# EAGLE design SP-PC (EAGLE 7.6.0)

## Sheet 1 of 2: Registers
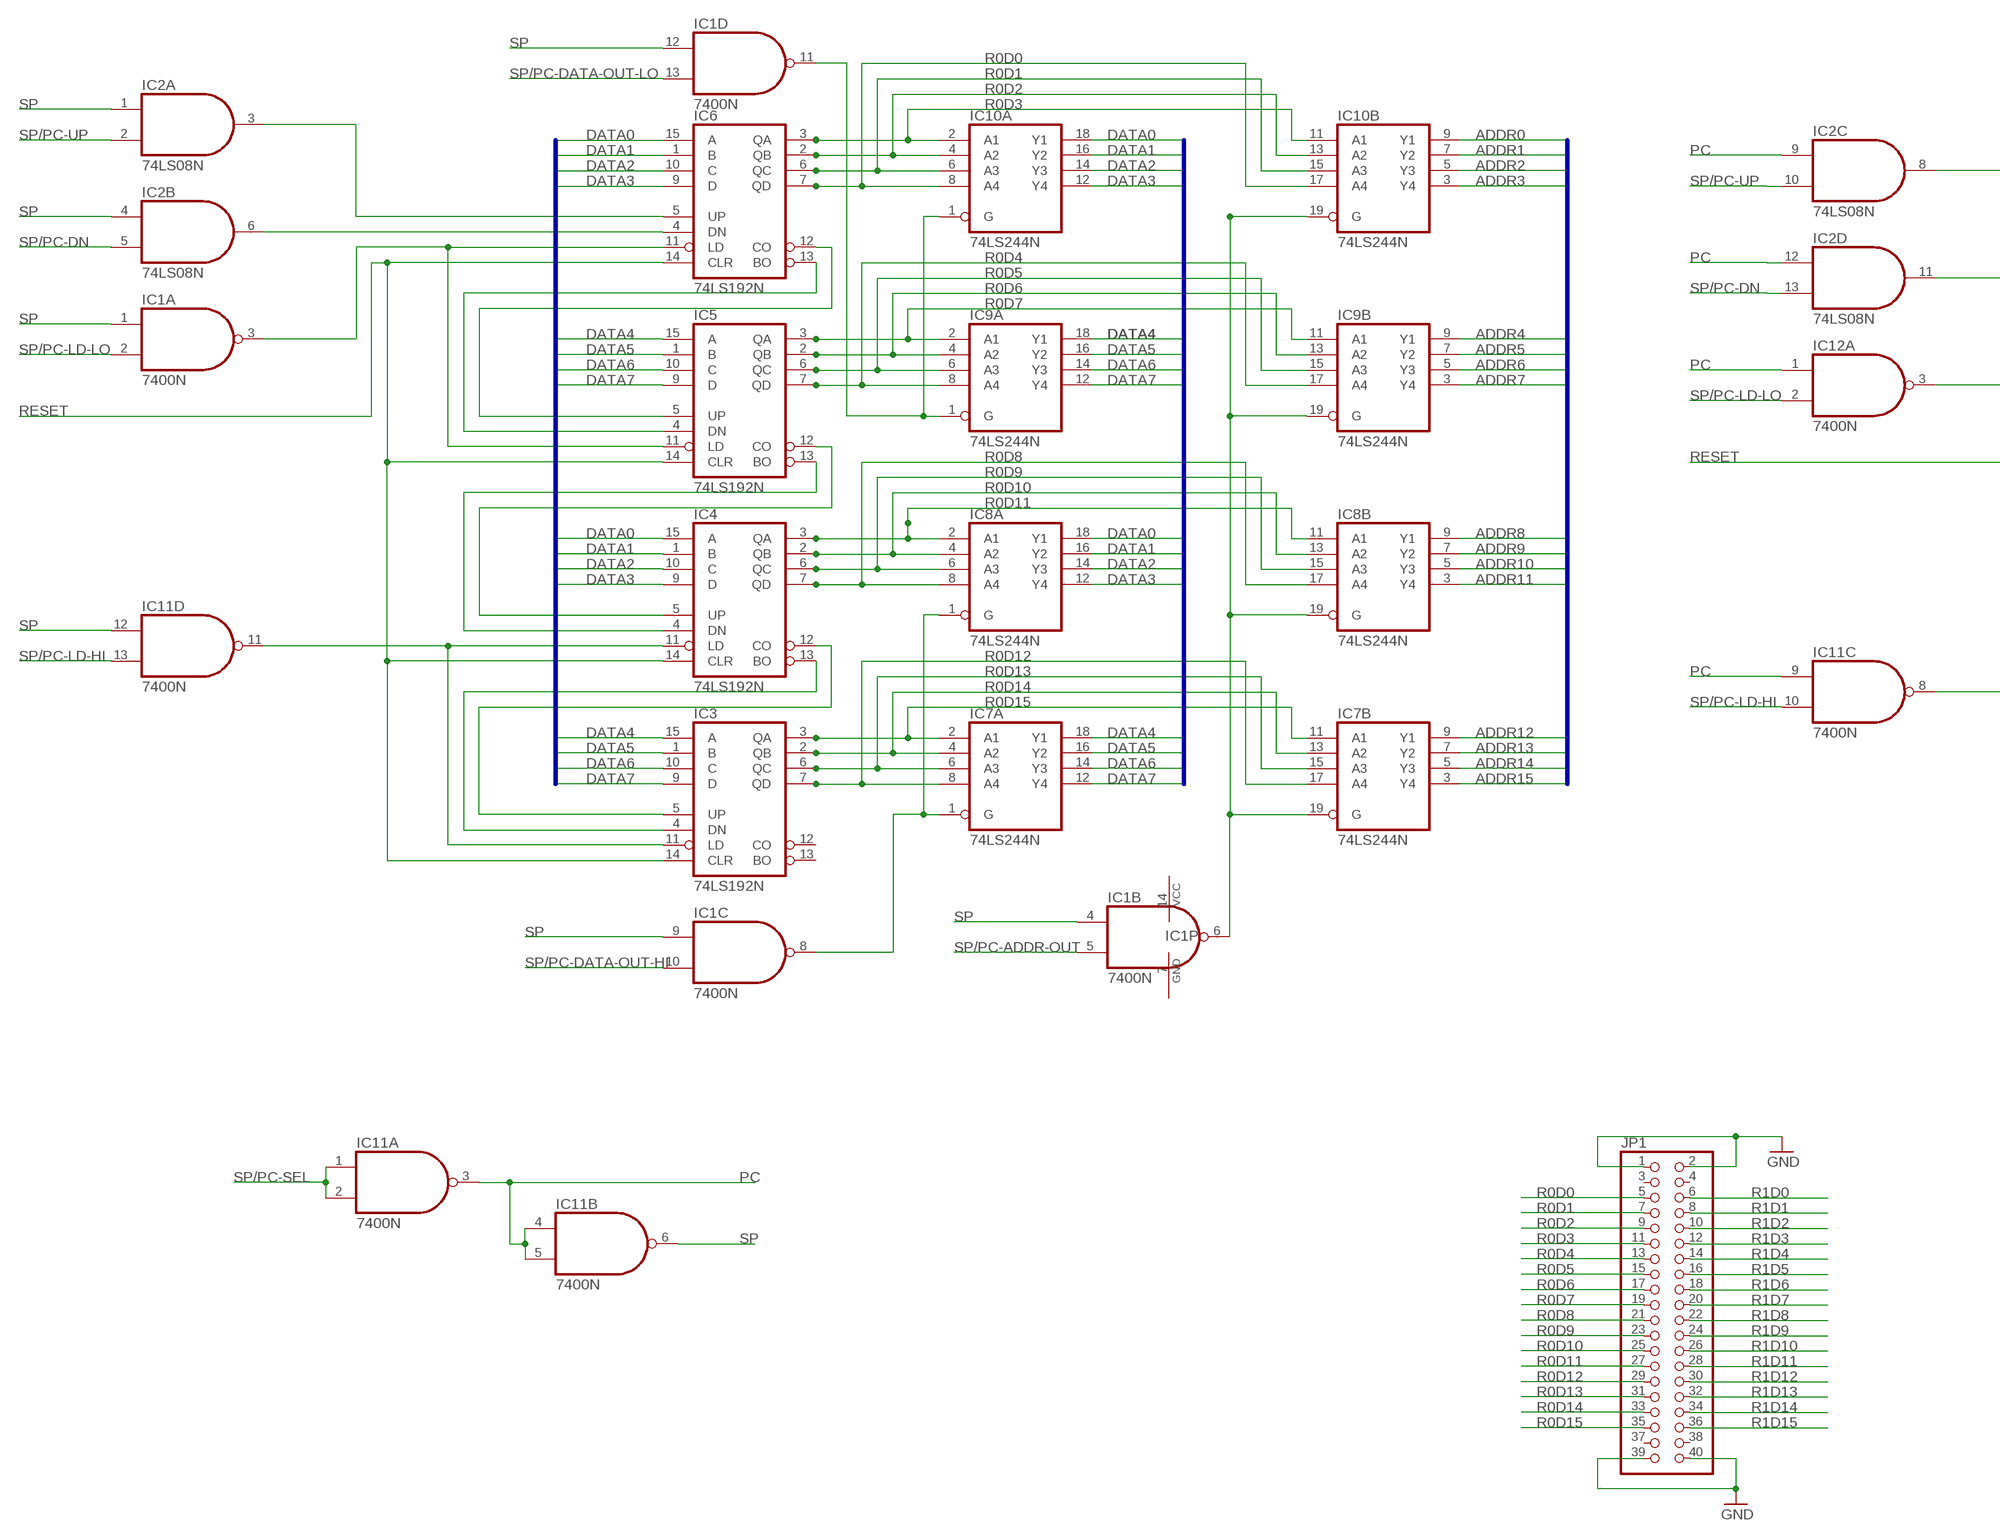
[diagram p0: schematic, sheet 1, part 1 of 2]
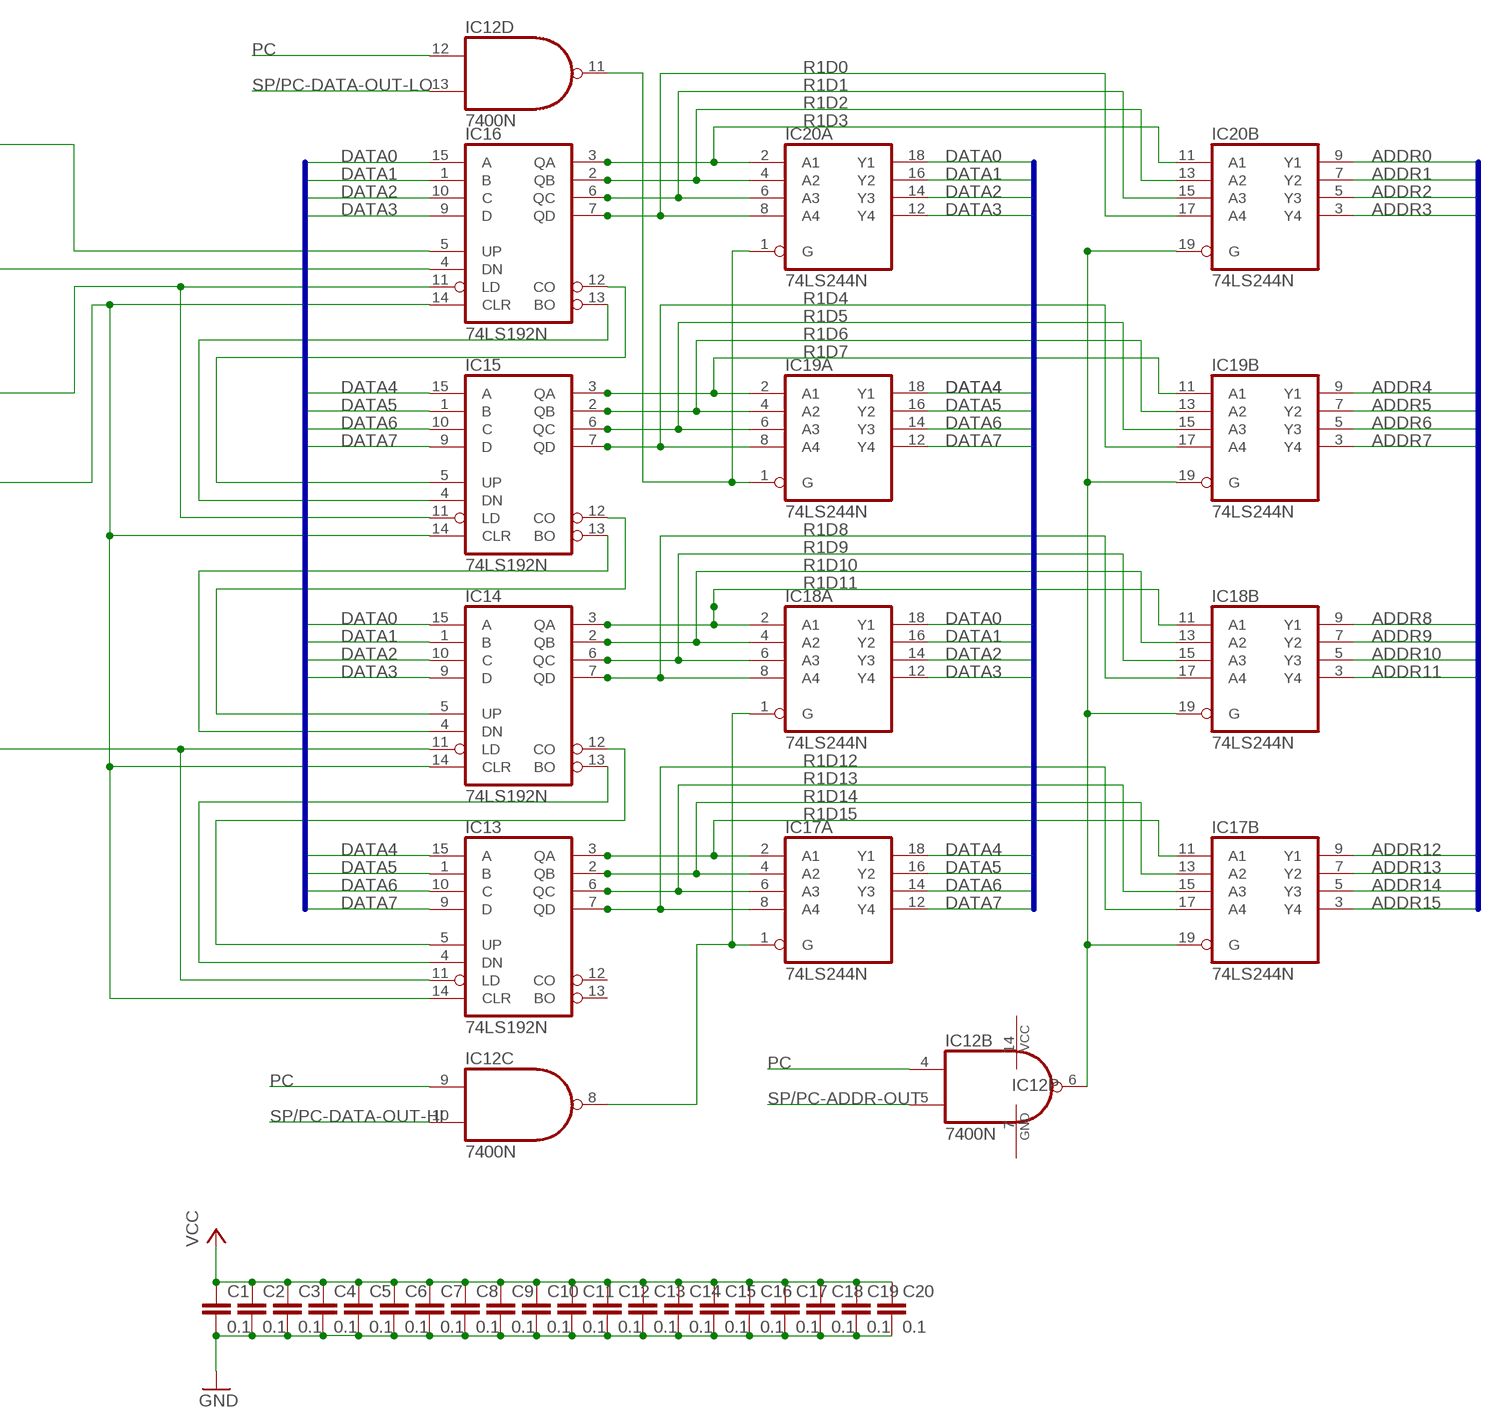
[diagram p1: schematic, sheet 1, part 2 of 2]

### Parts
C1  0.1  C2.5/2  [C2.5-2]
C2  0.1  C2.5/2  [C2.5-2]
C3  0.1  C2.5/2  [C2.5-2]
C4  0.1  C2.5/2  [C2.5-2]
C5  0.1  C2.5/2  [C2.5-2]
C6  0.1  C2.5/2  [C2.5-2]
C7  0.1  C2.5/2  [C2.5-2]
C8  0.1  C2.5/2  [C2.5-2]
C9  0.1  C2.5/2  [C2.5-2]
C10  0.1  C2.5/2  [C2.5-2]
C11  0.1  C2.5/2  [C2.5-2]
C12  0.1  C2.5/2  [C2.5-2]
C13  0.1  C2.5/2  [C2.5-2]
C14  0.1  C2.5/2  [C2.5-2]
C15  0.1  C2.5/2  [C2.5-2]
C16  0.1  C2.5/2  [C2.5-2]
C17  0.1  C2.5/2  [C2.5-2]
C18  0.1  C2.5/2  [C2.5-2]
C19  0.1  C2.5/2  [C2.5-2]
C20  0.1  C2.5/2  [C2.5-2]
IC1  7400N  [DIL14]
IC2  74LS08N  [DIL14]
IC3  74LS192N  [DIL16]
IC4  74LS192N  [DIL16]
IC5  74LS192N  [DIL16]
IC6  74LS192N  [DIL16]
IC7  74LS244N  [DIL20]
IC8  74LS244N  [DIL20]
IC9  74LS244N  [DIL20]
IC10  74LS244N  [DIL20]
IC11  7400N  [DIL14]
IC12  7400N  [DIL14]
IC13  74LS192N  [DIL16]
IC14  74LS192N  [DIL16]
IC15  74LS192N  [DIL16]
IC16  74LS192N  [DIL16]
IC17  74LS244N  [DIL20]
IC18  74LS244N  [DIL20]
IC19  74LS244N  [DIL20]
IC20  74LS244N  [DIL20]
JP1  PINHD-2X20  [2X20]

### Nets
ADDR0: IC10.9(B:Y1) IC20.9(B:Y1) ; also sheet 2
ADDR1: IC10.7(B:Y2) IC20.7(B:Y2) ; also sheet 2
ADDR2: IC10.5(B:Y3) IC20.5(B:Y3) ; also sheet 2
ADDR3: IC10.3(B:Y4) IC20.3(B:Y4) ; also sheet 2
ADDR4: IC9.9(B:Y1) IC19.9(B:Y1) ; also sheet 2
ADDR5: IC9.7(B:Y2) IC19.7(B:Y2) ; also sheet 2
ADDR6: IC9.5(B:Y3) IC19.5(B:Y3) ; also sheet 2
ADDR7: IC9.3(B:Y4) IC19.3(B:Y4) ; also sheet 2
ADDR8: IC8.9(B:Y1) IC18.9(B:Y1) ; also sheet 2
ADDR9: IC8.7(B:Y2) IC18.7(B:Y2) ; also sheet 2
ADDR10: IC8.5(B:Y3) IC18.5(B:Y3) ; also sheet 2
ADDR11: IC8.3(B:Y4) IC18.3(B:Y4) ; also sheet 2
ADDR12: IC7.9(B:Y1) IC17.9(B:Y1) ; also sheet 2
ADDR13: IC7.7(B:Y2) IC17.7(B:Y2) ; also sheet 2
ADDR14: IC7.5(B:Y3) IC17.5(B:Y3) ; also sheet 2
ADDR15: IC7.3(B:Y4) IC17.3(B:Y4) ; also sheet 2
DATA0: IC4.15(A) IC6.15(A) IC8.18(A:Y1) IC10.18(A:Y1) IC14.15(A) IC16.15(A) IC18.18(A:Y1) IC20.18(A:Y1) ; also sheet 2
DATA1: IC4.1(B) IC6.1(B) IC8.16(A:Y2) IC10.16(A:Y2) IC14.1(B) IC16.1(B) IC18.16(A:Y2) IC20.16(A:Y2) ; also sheet 2
DATA2: IC4.10(C) IC6.10(C) IC8.14(A:Y3) IC10.14(A:Y3) IC14.10(C) IC16.10(C) IC18.14(A:Y3) IC20.14(A:Y3) ; also sheet 2
DATA3: IC4.9(D) IC6.9(D) IC8.12(A:Y4) IC10.12(A:Y4) IC14.9(D) IC16.9(D) IC18.12(A:Y4) IC20.12(A:Y4) ; also sheet 2
DATA4: IC3.15(A) IC5.15(A) IC7.18(A:Y1) IC9.18(A:Y1) IC13.15(A) IC15.15(A) IC17.18(A:Y1) IC19.18(A:Y1) ; also sheet 2
DATA5: IC3.1(B) IC5.1(B) IC7.16(A:Y2) IC9.16(A:Y2) IC13.1(B) IC15.1(B) IC17.16(A:Y2) IC19.16(A:Y2) ; also sheet 2
DATA6: IC3.10(C) IC5.10(C) IC7.14(A:Y3) IC9.14(A:Y3) IC13.10(C) IC15.10(C) IC17.14(A:Y3) IC19.14(A:Y3) ; also sheet 2
DATA7: IC3.9(D) IC5.9(D) IC7.12(A:Y4) IC9.12(A:Y4) IC13.9(D) IC15.9(D) IC17.12(A:Y4) IC19.12(A:Y4) ; also sheet 2
GND: C1.2 C2.2 C3.2 C4.2 C5.2 C6.2 C7.2 C8.2 C9.2 C10.2 C11.2 C12.2 C13.2 C14.2 C15.2 C16.2 C17.2 C18.2 C19.2 C20.2 JP1.1 JP1.2 JP1.39 JP1.40 ; also sheet 2
N$10: IC5.4(DN) IC6.13(BO)
N$11: IC5.5(UP) IC6.12(CO)
N$12: IC4.4(DN) IC5.13(BO)
N$13: IC4.5(UP) IC5.12(CO)
N$14: IC3.4(DN) IC4.13(BO)
N$15: IC3.5(UP) IC4.12(CO)
N$16: IC1.3(A:O) IC5.11(LD) IC6.11(LD)
N$17: IC2.3(A:O) IC6.5(UP)
N$18: IC2.6(B:O) IC6.4(DN)
N$19: IC1.6(B:O) IC7.19(B:G) IC8.19(B:G) IC9.19(B:G) IC10.19(B:G)
N$20: IC1.11(D:O) IC9.1(A:G) IC10.1(A:G)
N$21: IC1.8(C:O) IC7.1(A:G) IC8.1(A:G)
N$22: IC3.11(LD) IC4.11(LD) IC11.11(D:O)
N$58: IC15.4(DN) IC16.13(BO)
N$59: IC15.5(UP) IC16.12(CO)
N$60: IC14.4(DN) IC15.13(BO)
N$61: IC14.5(UP) IC15.12(CO)
N$62: IC13.4(DN) IC14.13(BO)
N$63: IC13.5(UP) IC14.12(CO)
N$64: IC12.3(A:O) IC15.11(LD) IC16.11(LD)
N$65: IC2.8(C:O) IC16.5(UP)
N$66: IC2.11(D:O) IC16.4(DN)
N$83: IC12.6(B:O) IC17.19(B:G) IC18.19(B:G) IC19.19(B:G) IC20.19(B:G)
N$84: IC12.11(D:O) IC19.1(A:G) IC20.1(A:G)
N$85: IC12.8(C:O) IC17.1(A:G) IC18.1(A:G)
N$86: IC11.8(C:O) IC13.11(LD) IC14.11(LD)
PC: IC2.9(C:I0) IC2.12(D:I0) IC11.3(A:O) IC11.4(B:I0) IC11.5(B:I1) IC11.9(C:I0) IC12.1(A:I0) IC12.4(B:I0) IC12.9(C:I0) IC12.12(D:I0)
R0D0: IC6.7(QD) IC10.8(A:A4) IC10.17(B:A4) JP1.5
R0D1: IC6.6(QC) IC10.6(A:A3) IC10.15(B:A3) JP1.7
R0D2: IC6.2(QB) IC10.4(A:A2) IC10.13(B:A2) JP1.9
R0D3: IC6.3(QA) IC10.2(A:A1) IC10.11(B:A1) JP1.11
R0D4: IC5.7(QD) IC9.8(A:A4) IC9.17(B:A4) JP1.13
R0D5: IC5.6(QC) IC9.6(A:A3) IC9.15(B:A3) JP1.15
R0D6: IC5.2(QB) IC9.4(A:A2) IC9.13(B:A2) JP1.17
R0D7: IC5.3(QA) IC9.2(A:A1) IC9.11(B:A1) JP1.19
R0D8: IC4.7(QD) IC8.8(A:A4) IC8.17(B:A4) JP1.21
R0D9: IC4.6(QC) IC8.6(A:A3) IC8.15(B:A3) JP1.23
R0D10: IC4.2(QB) IC8.4(A:A2) IC8.13(B:A2) JP1.25
R0D11: IC4.3(QA) IC8.2(A:A1) IC8.11(B:A1) JP1.27
R0D12: IC3.7(QD) IC7.8(A:A4) IC7.17(B:A4) JP1.29
R0D13: IC3.6(QC) IC7.6(A:A3) IC7.15(B:A3) JP1.31
R0D14: IC3.2(QB) IC7.4(A:A2) IC7.13(B:A2) JP1.33
R0D15: IC3.3(QA) IC7.2(A:A1) IC7.11(B:A1) JP1.35
R1D0: IC16.7(QD) IC20.8(A:A4) IC20.17(B:A4) JP1.6
R1D1: IC16.6(QC) IC20.6(A:A3) IC20.15(B:A3) JP1.8
R1D2: IC16.2(QB) IC20.4(A:A2) IC20.13(B:A2) JP1.10
R1D3: IC16.3(QA) IC20.2(A:A1) IC20.11(B:A1) JP1.12
R1D4: IC15.7(QD) IC19.8(A:A4) IC19.17(B:A4) JP1.14
R1D5: IC15.6(QC) IC19.6(A:A3) IC19.15(B:A3) JP1.16
R1D6: IC15.2(QB) IC19.4(A:A2) IC19.13(B:A2) JP1.18
R1D7: IC15.3(QA) IC19.2(A:A1) IC19.11(B:A1) JP1.20
R1D8: IC14.7(QD) IC18.8(A:A4) IC18.17(B:A4) JP1.22
R1D9: IC14.6(QC) IC18.6(A:A3) IC18.15(B:A3) JP1.24
R1D10: IC14.2(QB) IC18.4(A:A2) IC18.13(B:A2) JP1.26
R1D11: IC14.3(QA) IC18.2(A:A1) IC18.11(B:A1) JP1.28
R1D12: IC13.7(QD) IC17.8(A:A4) IC17.17(B:A4) JP1.30
R1D13: IC13.6(QC) IC17.6(A:A3) IC17.15(B:A3) JP1.32
R1D14: IC13.2(QB) IC17.4(A:A2) IC17.13(B:A2) JP1.34
R1D15: IC13.3(QA) IC17.2(A:A1) IC17.11(B:A1) JP1.36
RESET: IC3.14(CLR) IC4.14(CLR) IC5.14(CLR) IC6.14(CLR) IC13.14(CLR) IC14.14(CLR) IC15.14(CLR) IC16.14(CLR) ; also sheet 2
SP: IC1.1(A:I0) IC1.4(B:I0) IC1.9(C:I0) IC1.12(D:I0) IC2.1(A:I0) IC2.4(B:I0) IC11.6(B:O) IC11.12(D:I0)
SP/PC-ADDR-OUT: IC1.5(B:I1) IC12.5(B:I1) ; also sheet 2
SP/PC-DATA-OUT-HI: IC1.10(C:I1) IC12.10(C:I1) ; also sheet 2
SP/PC-DATA-OUT-LO: IC1.13(D:I1) IC12.13(D:I1) ; also sheet 2
SP/PC-DN: IC2.5(B:I1) IC2.13(D:I1) ; also sheet 2
SP/PC-LD-HI: IC11.10(C:I1) IC11.13(D:I1) ; also sheet 2
SP/PC-LD-LO: IC1.2(A:I1) IC12.2(A:I1) ; also sheet 2
SP/PC-SEL: IC11.1(A:I0) IC11.2(A:I1) ; also sheet 2
SP/PC-UP: IC2.2(A:I1) IC2.10(C:I1) ; also sheet 2
VCC: C1.1 C2.1 C3.1 C4.1 C5.1 C6.1 C7.1 C8.1 C9.1 C10.1 C11.1 C12.1 C13.1 C14.1 C15.1 C16.1 C17.1 C18.1 C19.1 C20.1 ; also sheet 2
Unconnected: IC3.12(CO) IC3.13(BO) IC13.12(CO) IC13.13(BO) JP1.3 JP1.4 JP1.37 JP1.38

### Buses
ADDR[0..15]
DATA[0..7]

## Sheet 2 of 2: BUS
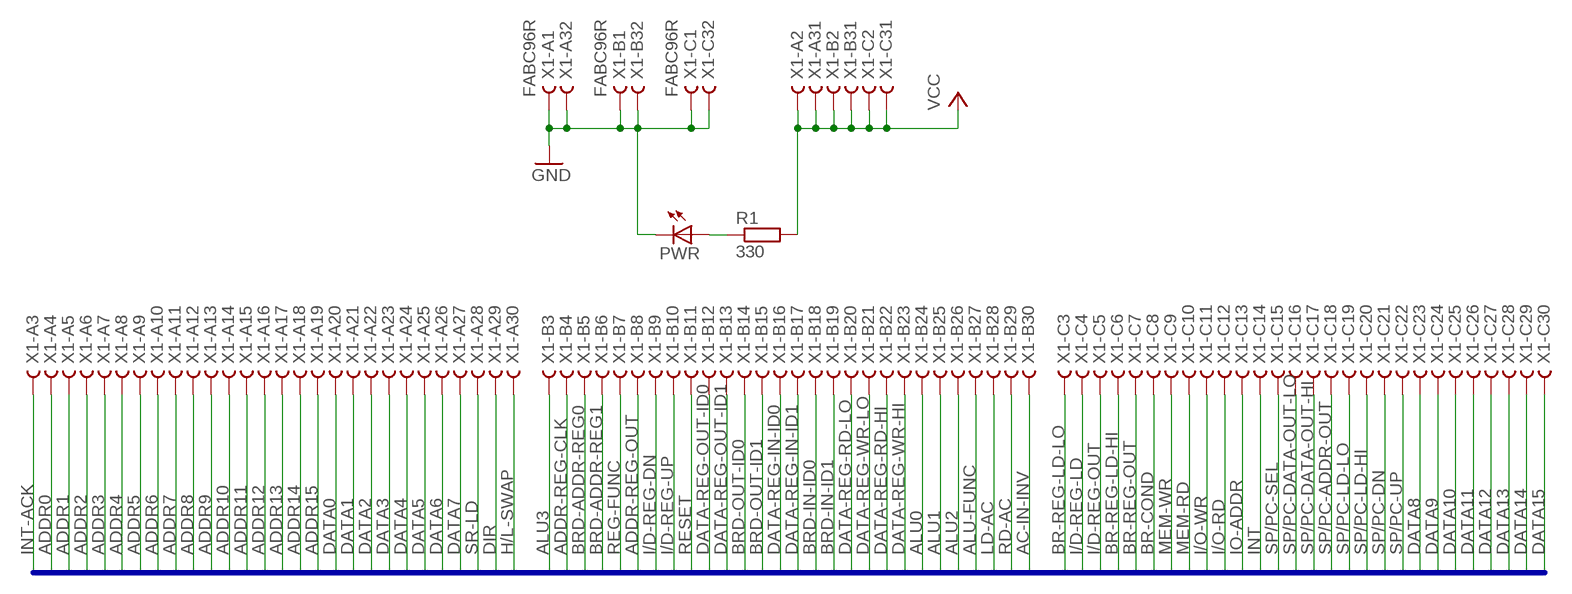
[diagram p2: schematic, sheet 2]

### Parts
PWR  LED5MM  [LED5MM]
R1  330  R0207/10  [0207/10]
X1  FABC96R  [FABC96R]

### Nets
AC-IN-INV: X1.B30
ADDR0: X1.A4 ; also sheet 1
ADDR1: X1.A5 ; also sheet 1
ADDR2: X1.A6 ; also sheet 1
ADDR3: X1.A7 ; also sheet 1
ADDR4: X1.A8 ; also sheet 1
ADDR5: X1.A9 ; also sheet 1
ADDR6: X1.A10 ; also sheet 1
ADDR7: X1.A11 ; also sheet 1
ADDR8: X1.A12 ; also sheet 1
ADDR9: X1.A13 ; also sheet 1
ADDR10: X1.A14 ; also sheet 1
ADDR11: X1.A15 ; also sheet 1
ADDR12: X1.A16 ; also sheet 1
ADDR13: X1.A17 ; also sheet 1
ADDR14: X1.A18 ; also sheet 1
ADDR15: X1.A19 ; also sheet 1
ADDR-REG-CLK: X1.B4
ADDR-REG-OUT: X1.B8
ALU0: X1.B24
ALU1: X1.B25
ALU2: X1.B26
ALU3: X1.B3
ALU-FUNC: X1.B27
BR-COND: X1.C8
BR-REG-LD-HI: X1.C6
BR-REG-LD-LO: X1.C3
BR-REG-OUT: X1.C7
BRD-ADDR-REG0: X1.B5
BRD-ADDR-REG1: X1.B6
BRD-IN-ID0: X1.B18
BRD-IN-ID1: X1.B19
BRD-OUT-ID0: X1.B14
BRD-OUT-ID1: X1.B15
DATA0: X1.A20 ; also sheet 1
DATA1: X1.A21 ; also sheet 1
DATA2: X1.A22 ; also sheet 1
DATA3: X1.A23 ; also sheet 1
DATA4: X1.A24 ; also sheet 1
DATA5: X1.A25 ; also sheet 1
DATA6: X1.A26 ; also sheet 1
DATA7: X1.A27 ; also sheet 1
DATA8: X1.C23
DATA9: X1.C24
DATA10: X1.C25
DATA11: X1.C26
DATA12: X1.C27
DATA13: X1.C28
DATA14: X1.C29
DATA15: X1.C30
DATA-REG-IN-ID0: X1.B16
DATA-REG-IN-ID1: X1.B17
DATA-REG-OUT-ID0: X1.B12
DATA-REG-OUT-ID1: X1.B13
DATA-REG-RD-HI: X1.B22
DATA-REG-RD-LO: X1.B20
DATA-REG-WR-HI: X1.B23
DATA-REG-WR-LO: X1.B21
DIR: X1.A29
GND: PWR.K(C) X1.A1 X1.A32 X1.B1 X1.B32 X1.C1 X1.C32 ; also sheet 1
H/L-SWAP: X1.A30
I/D-REG-DN: X1.B9
I/D-REG-LD: X1.C4
I/D-REG-OUT: X1.C5
I/D-REG-UP: X1.B10
I/O-RD: X1.C12
I/O-WR: X1.C11
INT: X1.C14
INT-ACK: X1.A3
IO-ADDR: X1.C13
LD-AC: X1.B28
MEM-RD: X1.C10
MEM-WR: X1.C9
N$1: PWR.A R1.1
RD-AC: X1.B29
REG-FUNC: X1.B7
RESET: X1.B11 ; also sheet 1
SP/PC-ADDR-OUT: X1.C18 ; also sheet 1
SP/PC-DATA-OUT-HI: X1.C17 ; also sheet 1
SP/PC-DATA-OUT-LO: X1.C16 ; also sheet 1
SP/PC-DN: X1.C21 ; also sheet 1
SP/PC-LD-HI: X1.C20 ; also sheet 1
SP/PC-LD-LO: X1.C19 ; also sheet 1
SP/PC-SEL: X1.C15 ; also sheet 1
SP/PC-UP: X1.C22 ; also sheet 1
SR-LD: X1.A28
VCC: R1.2 X1.A2 X1.A31 X1.B2 X1.B31 X1.C2 X1.C31 ; also sheet 1

### Buses
ADDR[0..15],DATA[0..15],SR-LD,DIR,H/L-SWAP,ADDR-REG-CLK,BRD-ADDR-REG[0..1],REG-FUNC,ADDR-REG-OUT,I/D-REG-DN,I/D-REG-UP,RESET,DATA-REG-OUT-ID[0..1],BRD-OUT-ID[0..1],DATA-REG-IN-ID[0..1],BRD-IN-ID[0..1],DATA-REG-RD-LO,DATA-REG-WR-LO,DATA-REG-RD-HI,DATA-REG-WR-HI,ALU[0..3],ALU-FUNC,LD-AC,RD-AC,AC-IN-INV,BR-REG-LD-LO,I/D-REG-LD,I/D-REG-OUT,BR-REG-LD-HI,BR-REG-OUT,BR-COND,MEM-WR,MEM-RD,I/O-WR,I/O-RD,IO-ADDR,INT,SP/PC-SEL,SP/PC-DATA-OUT-LO,SP/PC-DATA-OUT-HI,SP/PC-ADDR-OUT,SP/PC-LD-LO,SP/PC-LD-HI,SP/PC-DN,SP/PC-UP,INT-ACK

## Power pins joined to a net without a drawn wire
GND: IC1.7(P:GND) IC2.7(P:GND) IC3.8(GND) IC4.8(GND) IC5.8(GND) IC6.8(GND) IC7.10(P:GND) IC8.10(P:GND) IC9.10(P:GND) IC10.10(P:GND) IC11.7(P:GND) IC12.7(P:GND) IC13.8(GND) IC14.8(GND) IC15.8(GND) IC16.8(GND) IC17.10(P:GND) IC18.10(P:GND) IC19.10(P:GND) IC20.10(P:GND)
VCC: IC1.14(P:VCC) IC2.14(P:VCC) IC3.16(VCC) IC4.16(VCC) IC5.16(VCC) IC6.16(VCC) IC7.20(P:VCC) IC8.20(P:VCC) IC9.20(P:VCC) IC10.20(P:VCC) IC11.14(P:VCC) IC12.14(P:VCC) IC13.16(VCC) IC14.16(VCC) IC15.16(VCC) IC16.16(VCC) IC17.20(P:VCC) IC18.20(P:VCC) IC19.20(P:VCC) IC20.20(P:VCC)

## Library data of the parts
C1-C20 = capacitor-wima:C: CAPACITOR naming: grid - package width
IC1 IC11 IC12 = 74xx-us:74*00: Quad 2-input NAND gate
IC2 = 74xx-us:74*08: Quad 2-input AND gate
IC3-IC6 IC13-IC16 = 74xx-us:74*192: Synchronous 4-bit UP/DOWN COUNTER
IC7-IC10 IC17-IC20 = 74xx-us:74*244: Octal BUFFER and LINE DRIVER, 3-state
JP1 = pinhead:PINHD-2X20: PIN HEADER
PWR = led:LED: LED OSRAM: - CHIPLED LG R971, LG N971, LY N971, LG Q971, LY Q971, LO R971, LY R971 LH N974, LH R974 LS Q976, LO Q976, LY Q976 LO Q996 - Hyper CHIPLED LW Q18S LB Q993, LB Q99A, LB R99A - SideLED LS A670, LO A670, LY A670, LG A670, LP A670 LB A673, LV A673, LT A673, LW A673 LH A674 LY A675 LS A676, LA A676, LO A676, LY A676, LW A676 LS A679, LY A679, LG A679 - Hyper Micro SIDELED® LS Y876, LA Y876, LO Y876, LY Y876 LT Y87S - SmartLED LW L88C, LW L88S LB L89C, LB L89S, LG L890 LS L89K, LO L89K, LY L89K LS L896, LA L896, LO L896, LY L896 - TOPLED LS T670, LO T670, LY T670, LG T670, LP T670 LSG T670, LSP T670, LSY T670, LOP T670, LYG T670 LG T671, LOG T671, LSG T671 LB T673, LV T673, LT T673, LW T673 LH T674 LS T676, LA T676, LO T676, LY T676, LB T676, LH T676, LSB T676, LW T676 LB T67C, LV T67C, LT T67C, LS T67K, LO T67K, LY T67K, LW E67C LS E67B, LA E67B, LO E67B, LY E67B, LB E67C, LV E67C, LT E67C LW T67C LS T679, LY T679, LG T679 LS T770, LO T770, LY T770, LG T770, LP T770 LB T773, LV T773, LT T773, LW T773 LH T774 LS E675, LA E675, LY E675, LS T675 LS T776, LA T776, LO T776, LY T776, LB T776 LHGB T686 LT T68C, LB T68C - Hyper Mini TOPLED® LB M676 - Mini TOPLED Santana® LG M470 LS M47K, LO M47K, LY M47K Source: http://www.osram.convergy.de LUXEON: - LUMILED® LXK2-PW12-R00, LXK2-PW12-S00, LXK2-PW14-U00, LXK2-PW14-V00 LXK2-PM12-R00, LXK2-PM12-S00, LXK2-PM14-U00 LXK2-PE12-Q00, LXK2-PE12-R00, LXK2-PE12-S00, LXK2-PE14-T00, LXK2-PE14-U00 LXK2-PB12-K00, LXK2-PB12-L00, LXK2-PB12-M00, LXK2-PB14-N00, LXK2-PB14-P00, LXK2-PB14-Q00 LXK2-PR12-L00, LXK2-PR12-M00, LXK2-PR14-Q00, LXK2-PR14-R00 LXK2-PD12-Q00, LXK2-PD12-R00, LXK2-PD12-S00 LXK2-PH12-R00, LXK2-PH12-S00 LXK2-PL12-P00, LXK2-PL12-Q00, LXK2-PL12-R00 Source: www.luxeon.com KINGBRIGHT: KA-3528ASYC Source: www.kingbright.com
R1 = eagle-ltspice:R: RESISTOR, European symbol; SPICEMODEL: NONE; SPICEPREFIX: R
X1 = con-vg:FABC96R: CONNECTOR female, 96 pins, type R, rows ABC, grid 2.54 mm

## Board
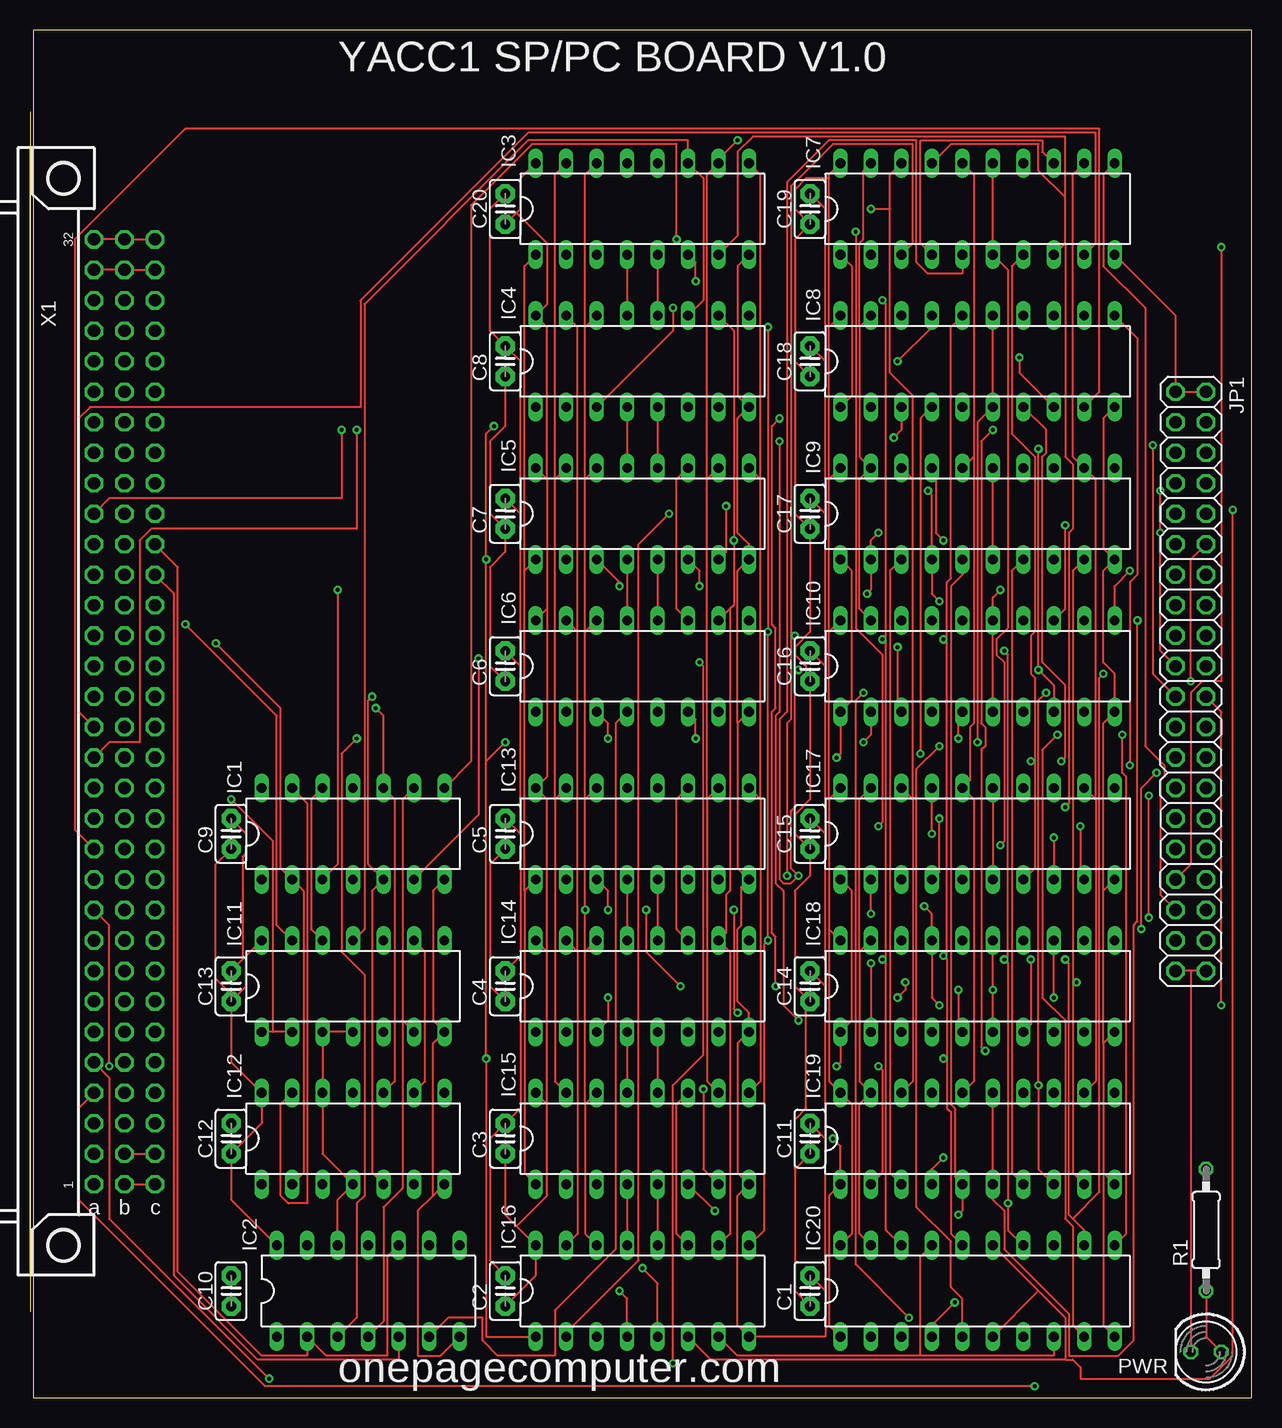
[diagram p3: board, top side]
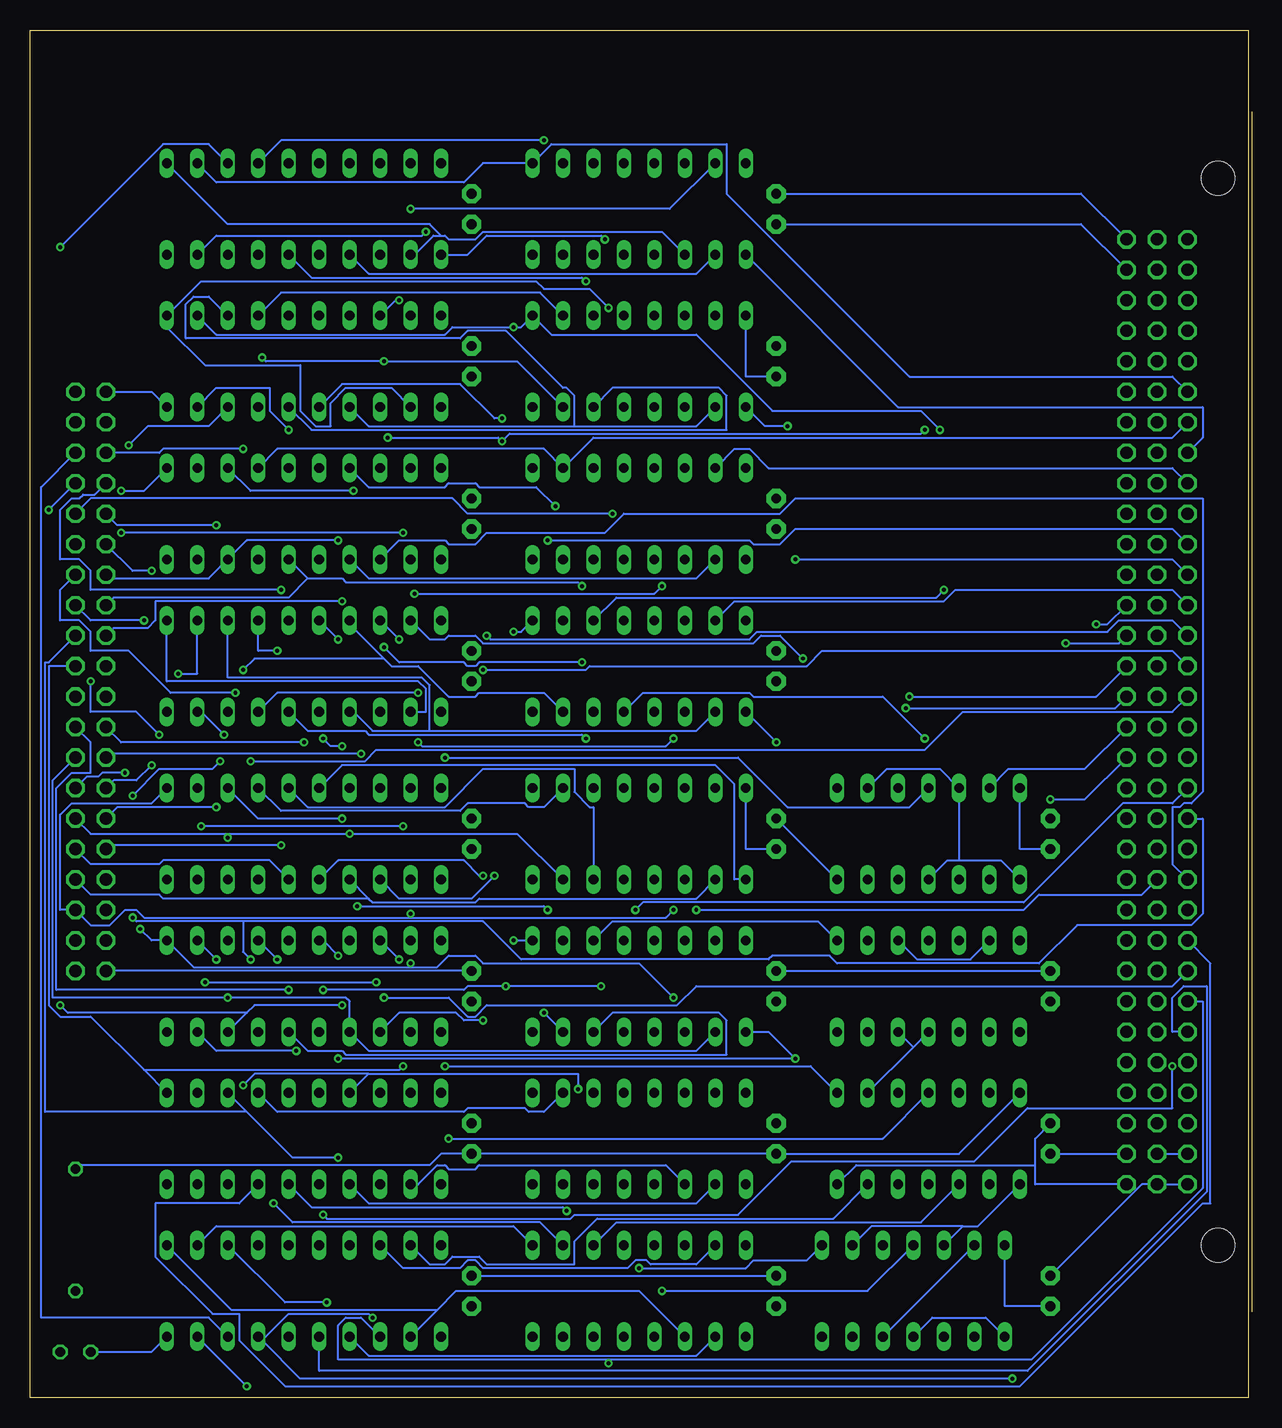
[diagram p4: board, bottom side, seen from below]

Size 101.58 x 113.97 mm. Coordinates in mm from the lower left corner, seen from the top.
Outline: 0,0 101.58,0 101.58,113.97 0,113.97 0,0
Copper layers (1*16): Top 0.0356mm / dielectric 1.5011mm / Bottom 0.0356mm
Design rules "LaenPCBOrder": minimum track width 6mil, minimum drill 13mil, track to track 6mil, track to pad 6mil, pad to pad 6mil, via to via 6mil, smd to smd 6mil, copper to edge 15mil, drill to drill 6mil, minimum pad ring 7mil, minimum via ring 7mil, stop-mask expansion 3mil, vias tented up to drill 0mil, thermal gap 10mil

### Footprints (pad centres in the part's own frame; a part is rotated, then mirrored left to right if it is on the bottom)
C2.5-2 = drill 0.813 pad 1.6 octagon: 1 -1.27,0; 2 1.27,0
DIL14 = drill 0.813 long: 1 -7.62,-3.81; 2 -5.08,-3.81; 3 -2.54,-3.81; 4 0,-3.81; 5 2.54,-3.81; 6 5.08,-3.81; 7 7.62,-3.81; 8 7.62,3.81; 9 5.08,3.81; 10 2.54,3.81; 11 0,3.81; 12 -2.54,3.81; 13 -5.08,3.81; 14 -7.62,3.81
DIL16 = drill 0.813 long: 1 -8.89,-3.81; 2 -6.35,-3.81; 3 -3.81,-3.81; 4 -1.27,-3.81; 5 1.27,-3.81; 6 3.81,-3.81; 7 6.35,-3.81; 8 8.89,-3.81; 9 8.89,3.81; 10 6.35,3.81; 11 3.81,3.81; 12 1.27,3.81; 13 -1.27,3.81; 14 -3.81,3.81; 15 -6.35,3.81; 16 -8.89,3.81
DIL20 = drill 0.813 long: 1 -11.43,-3.81; 2 -8.89,-3.81; 3 -6.35,-3.81; 4 -3.81,-3.81; 5 -1.27,-3.81; 6 1.27,-3.81; 7 3.81,-3.81; 8 6.35,-3.81; 9 8.89,-3.81; 10 11.43,-3.81; 11 11.43,3.81; 12 8.89,3.81; 13 6.35,3.81; 14 3.81,3.81; 15 1.27,3.81; 16 -1.27,3.81; 17 -3.81,3.81; 18 -6.35,3.81; 19 -8.89,3.81; 20 -11.43,3.81
2X20 = drill 1.016 octagon: 1 -24.13,-1.27; 2 -24.13,1.27; 3 -21.59,-1.27; 4 -21.59,1.27; 5 -19.05,-1.27; 6 -19.05,1.27; 7 -16.51,-1.27; 8 -16.51,1.27; 9 -13.97,-1.27; 10 -13.97,1.27; 11 -11.43,-1.27; 12 -11.43,1.27; 13 -8.89,-1.27; 14 -8.89,1.27; 15 -6.35,-1.27; 16 -6.35,1.27; 17 -3.81,-1.27; 18 -3.81,1.27; 19 -1.27,-1.27; 20 -1.27,1.27; 21 1.27,-1.27; 22 1.27,1.27; 23 3.81,-1.27; 24 3.81,1.27; 25 6.35,-1.27; 26 6.35,1.27; 27 8.89,-1.27; 28 8.89,1.27; 29 11.43,-1.27; 30 11.43,1.27; 31 13.97,-1.27; 32 13.97,1.27; 33 16.51,-1.27; 34 16.51,1.27; 35 19.05,-1.27; 36 19.05,1.27; 37 21.59,-1.27; 38 21.59,1.27; 39 24.13,-1.27; 40 24.13,1.27
LED5MM = drill 0.813 octagon: A -1.27,0; K 1.27,0
0207/10 = drill 0.813 octagon: 1 -5.08,0; 2 5.08,0
FABC96R = drill 1.016 octagon: A1 -2.54,39.37; A2 -2.54,36.83; A3 -2.54,34.29; A4 -2.54,31.75; A5 -2.54,29.21; A6 -2.54,26.67; A7 -2.54,24.13; A8 -2.54,21.59; A9 -2.54,19.05; A10 -2.54,16.51; A11 -2.54,13.97; A12 -2.54,11.43; A13 -2.54,8.89; A14 -2.54,6.35; A15 -2.54,3.81; A16 -2.54,1.27; A17 -2.54,-1.27; A18 -2.54,-3.81; A19 -2.54,-6.35; A20 -2.54,-8.89; A21 -2.54,-11.43; A22 -2.54,-13.97; A23 -2.54,-16.51; A24 -2.54,-19.05; A25 -2.54,-21.59; A26 -2.54,-24.13; A27 -2.54,-26.67; A28 -2.54,-29.21; A29 -2.54,-31.75; A30 -2.54,-34.29; A31 -2.54,-36.83; A32 -2.54,-39.37; B1 -5.08,39.37; B2 -5.08,36.83; B3 -5.08,34.29; B4 -5.08,31.75; B5 -5.08,29.21; B6 -5.08,26.67; B7 -5.08,24.13; B8 -5.08,21.59; B9 -5.08,19.05; B10 -5.08,16.51; B11 -5.08,13.97; B12 -5.08,11.43; B13 -5.08,8.89; B14 -5.08,6.35; B15 -5.08,3.81; B16 -5.08,1.27; B17 -5.08,-1.27; B18 -5.08,-3.81; B19 -5.08,-6.35; B20 -5.08,-8.89; B21 -5.08,-11.43; B22 -5.08,-13.97; B23 -5.08,-16.51; B24 -5.08,-19.05; B25 -5.08,-21.59; B26 -5.08,-24.13; B27 -5.08,-26.67; B28 -5.08,-29.21; B29 -5.08,-31.75; B30 -5.08,-34.29; B31 -5.08,-36.83; B32 -5.08,-39.37; C1 -7.62,39.37; C2 -7.62,36.83; C3 -7.62,34.29; C4 -7.62,31.75; C5 -7.62,29.21; C6 -7.62,26.67; C7 -7.62,24.13; C8 -7.62,21.59; C9 -7.62,19.05; C10 -7.62,16.51; C11 -7.62,13.97; C12 -7.62,11.43; C13 -7.62,8.89; C14 -7.62,6.35; C15 -7.62,3.81; C16 -7.62,1.27; C17 -7.62,-1.27; C18 -7.62,-3.81; C19 -7.62,-6.35; C20 -7.62,-8.89; C21 -7.62,-11.43; C22 -7.62,-13.97; C23 -7.62,-16.51; C24 -7.62,-19.05; C25 -7.62,-21.59; C26 -7.62,-24.13; C27 -7.62,-26.67; C28 -7.62,-29.21; C29 -7.62,-31.75; C30 -7.62,-34.29; C31 -7.62,-36.83; C32 -7.62,-39.37 | hole 2.794: 0,-44.456; 0,44.456

### Placement (x,y rotation side)
C1  64.77,8.89 90 top
C2  39.37,8.89 90 top
C3  39.37,21.59 90 top
C4  39.37,34.29 90 top
C5  39.37,46.99 90 top
C6  39.37,60.96 90 top
C7  39.37,73.66 90 top
C8  39.37,86.36 90 top
C9  16.51,46.99 90 top
C10  16.51,8.89 90 top
C11  64.77,21.59 90 top
C12  16.51,21.59 90 top
C13  16.51,34.29 90 top
C14  64.77,34.29 90 top
C15  64.77,46.99 90 top
C16  64.77,60.96 90 top
C17  64.77,73.66 90 top
C18  64.77,86.36 90 top
C19  64.77,99.06 90 top
C20  39.37,99.06 90 top
IC1  26.67,46.99 0 top
IC2  27.94,8.89 0 top
IC3  50.8,99.06 0 top
IC4  50.8,86.36 0 top
IC5  50.8,73.66 0 top
IC6  50.8,60.96 0 top
IC7  78.74,99.06 0 top
IC8  78.74,86.36 0 top
IC9  78.74,73.66 0 top
IC10  78.74,60.96 0 top
IC11  26.67,34.29 0 top
IC12  26.67,21.59 0 top
IC13  50.8,46.99 0 top
IC14  50.8,34.29 0 top
IC15  50.8,21.59 0 top
IC16  50.8,8.89 0 top
IC17  78.74,46.99 0 top
IC18  78.74,34.29 0 top
IC19  78.74,21.59 0 top
IC20  78.74,8.89 0 top
JP1  96.52,59.69 270 top
PWR  97.79,3.81 180 top
R1  97.79,13.97 90 top
X1  2.54,57.15 180 top

### Tracks (layer width: path | path; a pad name or v marks a point on that pad's centre or on a via)
ADDR0  (via drill 0.33)
  Top 0.152: IC20.9 86.68,6.03 86.68,14.29 86.04,14.92 86.04,31.43 84.14,33.34 84.14,53.98 v85.41,55.24 | X1.A4 3.81,24.13 3.81,16.51 19.37,0.95 v83.5,0.95
  Bottom 0.152: v85.41,55.24 87.31,57.15 IC10.9 | IC20.9 v83.5,0.95
ADDR1  (via drill 0.33)
  Top 0.152: v19.68,1.59 6.35,14.92 6.35,26.67 X1.A5 | v69.22,58.74 68.58,58.1 68.58,11.11 v73.03,6.67
  Bottom 0.152: 82.23,4.76 79.06,1.59 v19.68,1.59 | IC10.7 80.96,58.74 v69.22,58.74 | v73.03,6.67 73.34,6.99 80.01,6.99 82.23,4.76 | 82.23,4.76 IC20.7
ADDR2  (via drill 0.33)
  Top 0.152: IC10.5 77.15,56.83 v77.15,54.93 | v75.56,54.29 73.66,52.39 73.66,15.88 76.52,13.02 76.52,9.21 77.47,8.26 IC20.5
  Bottom 0.152: IC20.5 77.47,2.22 18.41,2.22 3.49,17.14 3.49,34.29 5.4,34.29 6.35,33.34 6.35,30.48 X1.A6 | v77.15,54.93 76.52,54.29 v75.56,54.29
ADDR3  (via drill 0.33)
  Top 0.152: IC10.3 72.07,57.47 v72.07,62.55 | v55.56,61.28 55.88,60.96 55.88,28.57 53.34,26.04 v53.34,2.86
  Bottom 0.152: IC20.3 73.98,6.67 75.25,6.67 75.88,6.03 75.88,3.17 53.34,3.17 | 53.34,3.17 18.1,3.17 3.81,17.46 3.81,33.02 X1.A7 | v72.07,62.55 70.8,61.28 65.41,61.28 65.09,60.96 64.45,60.96 64.14,61.28 v55.56,61.28 | 53.34,3.17 v53.34,2.86
ADDR4  (via drill 0.33)
  Top 0.152: IC19.9 86.68,18.73 86.68,34.61 | 86.68,34.61 86.68,68.9 IC9.9 | v72.07,33.34 72.71,33.97 v72.71,34.61 | 86.68,34.61 v87,34.61
  Bottom 0.152: X1.A8 6.35,34.29 46.04,34.29 47.62,32.7 63.5,32.7 64.45,31.75 65.09,31.75 66.67,33.34 v72.07,33.34 | v87,34.61 v72.71,34.61
ADDR5
  Top 0.152: IC19.7 81.6,18.73 81.6,68.9 IC9.7
  Bottom 0.152: X1.A9 3.17,36.2 3.17,16.19 3.81,16.19 19.05,0.95 80.33,0.95 84.14,4.76 84.14,6.99 86.36,6.99 91.12,11.75 91.12,16.19 84.14,16.19 IC19.7
ADDR6  (via drill 0.33)
  Top 0.152: IC9.5 77.47,68.58 76.52,67.63 76.52,24.45 76.83,24.13 76.83,18.41 IC19.5 77.47,15.56 v77.15,15.24 | X1.A10 6.35,39.37 v6.35,27.62
  Bottom 0.152: v6.35,27.62 6.35,24.13 18.41,24.13 22.86,19.68 38.1,19.68 42.55,15.24 56.2,15.24 56.52,14.92 76.83,14.92 v77.15,15.24
ADDR7
  Top 0.152: IC19.3 71.44,18.73 71.44,68.9 IC9.3
  Bottom 0.152: X1.A11 6.35,44.45 6.35,49.21 5.71,49.21 5.4,49.53 4.76,49.53 3.81,50.48 3.81,74.93 37.78,74.93 39.05,73.66 52.07,73.66 53.66,72.07 63.5,72.07 64.45,71.12 66.67,71.12 66.99,71.44 70.8,71.44 IC9.3
ADDR8  (via drill 0.33)
  Top 0.152: v79.38,28.89 79.06,29.21 79.06,53.98 79.38,54.29 79.38,55.88 79.06,56.2 79.06,79.69 v80.01,80.64 | X1.A12 3.49,47.31 3.49,96.52 12.7,105.73 88.9,105.73 88.9,83.82 IC8.9
  Bottom 0.152: IC18.9 86.04,28.89 v79.38,28.89 | v80.01,80.64 81.6,82.23 81.6,84.14 86.04,84.14 IC8.9
ADDR9  (via drill 0.33)
  Top 0.152: IC18.7 83.19,31.11 v83.19,36.51 | IC8.7 84.45,80.64 84.45,78.74 84.14,78.42 84.14,61.28 86.04,59.37 86.04,53.34 v85.72,53.02 | v93.03,40.01 v93.03,50.16
  Bottom 0.152: v83.19,36.51 83.82,37.15 83.82,39.69 | 83.82,39.69 63.82,39.69 60.64,36.51 40.01,36.51 39.69,36.83 34.92,36.83 34.29,36.2 17.46,36.2 14.29,39.37 4.76,39.37 3.81,40.32 3.81,48.26 X1.A13 | v85.72,53.02 86.36,52.39 90.81,52.39 v93.03,50.16 | v93.03,40.01 92.71,39.69 83.82,39.69
ADDR10  (via drill 0.33)
  Top 0.152: IC18.5 77.15,30.8 v77.15,33.97 | v53.98,34.29 51.12,37.15 v51.12,40.64 | v62.23,81.6 61.59,80.96 61.59,64.45 61.91,64.14 61.91,57.47 61.59,57.15 61.59,38.73 61.91,38.42 v61.91,34.29
  Bottom 0.152: v77.15,33.97 65.41,33.97 65.09,34.29 v61.91,34.29 v53.98,34.29 | v51.12,40.64 50.48,41.27 18.73,41.27 10.48,49.53 6.35,49.53 X1.A14 | IC8.5 75.56,84.45 65.72,84.45 62.87,81.6 v62.23,81.6
ADDR11  (via drill 0.33)
  Top 0.152: v63.82,31.43 62.55,32.7 62.55,42.23 61.91,42.86 61.91,56.83 62.23,57.15 v62.23,79.69 | v71.75,80.01 72.39,80.64 IC8.3 | X1.A15 6.35,54.61 8.89,54.61 8.89,71.44 9.84,72.39 26.99,72.39 v26.99,80.64
  Bottom 0.152: IC18.3 70.8,32.07 66.04,32.07 65.41,31.43 v63.82,31.43 | v71.75,80.01 62.55,80.01 v62.23,79.69 61.59,80.33 27.3,80.33 v26.99,80.64
ADDR12  (via drill 0.33)
  Top 0.152: IC17.9 87.31,43.5 v87.31,47.62 | v70.48,47.62 70.8,47.94 70.8,61.91 68.58,64.14 v68.58,97.16 | X1.A16 3.81,57.15 3.81,81.6 4.76,82.55 27.3,82.55 27.3,91.44 41.27,105.41 88.58,105.41 88.58,96.2 IC7.9
  Bottom 0.152: v70.48,47.62 v87.31,47.62 | v68.58,97.16 68.9,96.84 86.04,96.84 IC7.9
ADDR13  (via drill 0.33)
  Top 0.152: IC17.7 83.5,44.13 83.5,53.02 | 83.5,53.02 83.5,60.01 83.19,60.33 83.19,63.5 83.5,63.82 83.5,78.42 81.6,80.33 81.6,94.3 IC7.7 | 83.5,53.02 v83.19,53.02
  Bottom 0.152: X1.A17 6.35,57.15 23.81,57.15 26.99,53.98 72.71,53.98 73.66,53.02 v83.19,53.02
ADDR14  (via drill 0.33)
  Top 0.152: IC7.5 77.47,93.66 74.61,93.66 73.66,94.61 73.66,104.78 66.36,104.78 62.87,101.28 62.87,57.15 62.23,56.52 62.23,43.18 62.55,42.86 63.18,42.86 v63.82,43.5 63.18,44.13 63.18,48.9 63.5,49.21 63.5,60.33 v63.82,60.64
  Bottom 0.152: IC17.5 75.88,44.77 65.41,44.77 64.14,43.5 v63.82,43.5 | X1.A18 6.35,62.23 35.56,62.23 36.83,60.96 54.93,60.96 55.24,60.64 v63.82,60.64
ADDR15  (via drill 0.33)
  Top 0.152: v62.87,43.5 62.87,56.2 63.18,56.52 63.18,63.5 | 63.18,63.5 63.18,100.97 66.67,104.46 73.34,104.46 73.34,96.2 IC7.3 | 63.18,63.5 v63.5,63.5
  Bottom 0.152: IC17.3 70.8,41.59 64.77,41.59 v62.87,43.5 | X1.A19 6.35,64.77 10.79,64.77 11.75,63.82 40.96,63.82 41.59,63.18 63.18,63.18 v63.5,63.5
DATA0  (via drill 0.33)
  Top 0.152: IC16.15 45.4,13.65 45.4,37.15 | IC14.15 45.4,37.15 | 71.12,36.2 v70.8,36.51 | 71.12,36.2 71.12,13.97 IC20.18 | 45.4,63.82 IC6.15 | 45.4,37.15 45.4,63.82 | 71.12,62.87 v70.8,63.18 | 71.12,36.2 71.12,62.87 | IC4.15 45.4,89.22 45.4,63.82 | v70.8,91.44 71.12,91.12 71.12,62.87
  Bottom 0.152: IC20.18 70.48,10.79 65.72,10.79 65.09,11.43 64.45,11.43 63.82,10.79 51.75,10.79 51.12,11.43 50.16,11.43 49.85,11.11 46.04,11.11 IC16.15 | v70.8,36.51 IC18.18 | v70.8,63.18 IC10.18 | IC8.18 71.12,91.44 v70.8,91.44 | X1.A20 6.35,67.31 24.45,67.31 25.4,66.36 42.86,66.36 IC6.15
DATA1  (via drill 0.33)
  Top 0.152: IC20.16 76.52,13.65 76.52,23.81 76.2,24.13 76.2,28.26 | 76.2,36.51 76.2,28.26 | v75.88,36.83 76.2,36.51 | 76.2,62.87 v75.88,63.18 | 76.2,36.51 76.2,62.87 | IC8.16 76.52,89.22 76.52,68.26 76.2,67.94 76.2,62.87 | IC16.1 37.78,5.08 v37.78,28.26 37.78,53.02 | 37.78,53.02 v39.37,54.61 | v38.42,80.96 37.78,80.33 v37.78,69.85 37.78,53.02 | v75.88,28.26 76.2,28.26
  Bottom 0.152: v75.88,36.83 77.15,38.1 IC18.16 | v75.88,63.18 IC10.16 | IC14.1 40.01,30.48 v37.78,28.26 v75.88,28.26 | v39.37,54.61 IC6.1 | IC4.1 40.32,80.96 v38.42,80.96 | X1.A21 6.35,69.85 v37.78,69.85
DATA2  (via drill 0.33)
  Top 0.152: IC20.14 81.28,13.97 v81.28,16.19 81.28,36.2 | v80.96,36.51 81.28,36.2 | v80.96,62.23 81.28,61.91 81.28,36.2 | IC16.10 58.1,13.65 58.1,37.15 IC14.10 57.78,38.73 57.78,41.91 58.1,42.23 58.1,65.72 | 58.1,65.72 58.42,66.04 v58.42,71.44 58.42,88.9 IC4.10 | 58.1,65.72 IC6.10
  Bottom 0.152: IC18.14 v80.96,36.51 | IC10.14 82.55,62.23 v80.96,62.23 | IC8.14 80.64,92.08 59.05,92.08 IC4.10 | X1.A22 6.35,72.39 37.78,72.39 39.05,71.12 41.27,71.12 41.59,71.44 v58.42,71.44 | v81.28,16.19 79.69,14.61 59.05,14.61 IC16.10
DATA3  (via drill 0.33)
  Top 0.152: IC16.9 60.96,13.97 60.96,37.78 v61.28,38.1 v61.28,63.82 v61.28,89.22 | v86.04,36.51 86.36,36.2 86.36,15.24 86.68,14.92 | 86.68,14.92 87.63,13.97 IC20.12 | v89.22,60.33 88.9,60.01 88.9,17.14 86.68,14.92 | X1.A23 6.35,74.93 25.72,74.93 v25.72,80.64
  Bottom 0.152: IC16.9 61.28,14.29 86.04,14.29 IC20.12 | v61.28,38.1 IC14.9 | IC6.9 60.64,63.82 v61.28,63.82 | v86.04,36.51 IC18.12 | IC10.12 87.63,60.33 v89.22,60.33 | IC8.12 86.04,88.58 66.99,88.58 66.36,89.22 v61.28,89.22 60.64,89.22 IC4.9 58.1,88.58 46.04,88.58 39.69,82.23 27.3,82.23 v25.72,80.64
DATA4  (via drill 0.33)
  Top 0.152: IC19.18 73.34,26.35 73.34,49.85 | IC17.18 73.34,49.85 | 73.34,76.52 IC9.18 | 73.34,49.85 73.34,76.52 | IC7.18 71.44,101.92 71.44,99.06 | 71.44,99.06 71.44,85.41 73.34,83.5 73.34,76.52 | IC15.15 43.5,26.35 43.5,49.85 | IC13.15 43.5,49.85 | 43.5,76.52 IC5.15 | 43.5,49.85 43.5,76.52 | IC3.15 43.5,101.92 43.5,76.52 | v69.85,99.06 71.44,99.06
  Bottom 0.152: X1.A24 6.35,77.47 40.01,77.47 41.59,79.06 42.86,79.06 IC5.15 | v69.85,99.06 48.26,99.06 IC3.15
DATA5
  Top 0.152: IC19.16 78.42,26.35 78.42,49.85 IC17.16 78.11,51.44 78.11,55.88 78.42,56.2 78.42,78.42 | 78.42,78.42 IC9.16 | 78.42,78.42 78.42,101.92 IC7.16 | IC15.1 40.96,18.73 40.96,42.23 | IC13.1 40.96,42.23 | 40.96,68.9 IC5.1 | 40.96,42.23 40.96,68.9 | IC3.1 40.96,94.3 40.96,68.9
  Bottom 0.152: X1.A25 3.81,80.01 3.81,82.55 29.21,82.55 IC3.1 | IC17.16 75.56,52.7 44.45,52.7 42.86,51.12 42.86,43.18 IC13.1
DATA6  (via drill 0.33)
  Top 0.152: IC15.10 56.2,26.35 56.2,49.85 | IC13.10 56.2,49.85 | 56.2,76.52 IC5.10 | 56.2,49.85 56.2,76.52 | 56.2,76.52 56.2,101.92 IC3.10 57.15,103.19 v58.74,104.78
  Bottom 0.152: IC19.14 80.96,23.81 65.41,23.81 65.09,24.13 60.33,24.13 60.01,23.81 58.74,23.81 IC15.10 | IC17.14 80.64,48.9 65.72,48.9 65.09,49.53 60.33,49.53 60.01,49.21 58.74,49.21 IC13.10 | IC9.14 80.96,79.06 58.74,79.06 IC5.10 54.61,80.01 6.35,80.01 X1.A26 | IC7.14 80.64,104.78 v58.74,104.78
DATA7
  Top 0.152: IC19.12 88.58,26.35 88.58,49.85 | IC17.12 88.58,49.85 | 88.58,49.85 88.58,76.52 IC9.12 86.68,78.42 86.68,101.92 IC7.12 | IC15.9 60.64,26.35 60.64,49.85 | IC13.9 60.64,49.85 | 60.64,76.52 IC5.9 | 60.64,49.85 60.64,76.52 | IC3.9 60.64,101.92 60.64,76.52
  Bottom 0.152: X1.A27 6.35,85.09 28.26,85.09 43.5,100.33 43.5,104.46 58.1,104.46 IC3.9 63.82,102.87 65.41,101.28 86.04,101.28 IC7.12
GND
  Top 0.152: X1.B1 X1.C1 | IC2.7 33.97,3.49 32.07,3.49 32.07,15.56 33.34,16.83 | IC12.7 33.34,16.83 | 33.34,16.83 33.34,29.53 IC11.7 33.34,31.43 33.34,42.23 IC1.7 | C13.2 17.46,36.51 17.46,45.09 17.78,45.4 17.78,46.99 C9.2 | C2.2 38.1,11.43 38.1,21.59 C3.2 40.64,24.13 40.64,36.83 | X1.A32 X1.B32 X1.C32 | 40.64,36.83 C4.2 | 40.64,46.99 40.64,36.83 | C5.2 40.64,46.99 | 40.64,60.96 C6.2 | 40.64,46.99 40.64,60.96 | 40.64,73.66 C7.2 | 40.64,60.96 40.64,73.66 | 40.64,73.66 40.64,86.36 C8.2 38.1,88.9 38.1,99.06 C20.2 | IC8.10 89.22,81.6 89.22,70.8 IC9.10 89.22,68.9 89.22,61.28 90.17,60.33 IC10.10 89.22,56.2 89.22,42.23 | IC7.10 95.25,90.17 JP1.1 JP1.2 | 89.22,18.73 IC19.10 | 89.22,29.53 89.22,18.73 | IC18.10 89.22,29.53 | 89.22,42.23 IC17.10 | 89.22,29.53 89.22,42.23 | IC20.10 89.22,6.03 89.22,18.73 | IC3.8 58.74,94.3 58.74,83.5 IC4.8 58.74,81.6 58.74,72.07 59.69,71.12 IC5.8 58.74,68.9 58.74,56.2 | 58.74,56.2 58.74,44.13 IC13.8 59.05,42.55 59.05,39.37 58.74,39.05 58.74,33.02 59.69,32.07 IC14.8 58.74,29.53 58.74,18.73 IC15.8 58.74,16.83 58.74,6.03 IC16.8 66.04,5.08 66.04,8.89 | IC6.8 58.74,56.2 | JP1.40 96.52,35.56 | 96.52,35.56 JP1.39 | C1.2 66.04,8.89 | 66.04,21.59 C11.2 | 66.04,8.89 66.04,21.59 | 66.04,34.29 C14.2 | 66.04,21.59 66.04,34.29 | 66.04,46.99 C15.2 | 66.04,34.29 66.04,46.99 | 66.04,60.96 C16.2 | 66.04,46.99 66.04,60.96 | 66.04,73.66 C17.2 | 66.04,60.96 66.04,73.66 | 66.04,86.36 C18.2 | 66.04,73.66 66.04,86.36 | C19.2 66.04,99.06 66.04,86.36 | 96.52,35.56 PWR.K
  Bottom 0.152: X1.A1 X1.B1 8.89,17.78 C10.2 | C12.2 17.78,21.59 17.78,19.37 | 17.78,19.37 17.78,17.78 X1.C1 | 17.78,19.37 32.7,19.37 IC12.7 | C5.2 IC1.7 | X1.C32 13.97,100.33 C20.2 | C4.2 C13.2 | IC8.10 91.44,83.82 JP1.1 | IC20.10 91.44,3.81 PWR.K | C14.2 JP1.39 | C1.2 C2.2
N$1
  Top 0.152: PWR.A 97.79,5.08 R1.1
N$10
  Top 0.152: IC5.4 IC6.13
N$11
  Top 0.152: IC5.5 IC6.12
N$12
  Top 0.152: IC4.4 IC5.13
N$13
  Top 0.152: IC4.5 IC5.12
N$14
  Top 0.152: IC3.4 IC4.13
N$15
  Top 0.152: IC3.5 IC4.12
N$16  (via drill 0.33)
  Top 0.152: IC1.3 25.4,44.45 v25.4,67.31 | IC5.11 53.66,76.52 53.66,65.72 IC6.11
  Bottom 0.152: v25.4,67.31 26.04,66.67 52.7,66.67 IC6.11
N$17  (via drill 0.33)
  Top 0.152: IC2.3 26.99,6.67 26.99,16.19 27.62,16.83 27.62,35.24 25.72,37.15 25.72,53.66 v26.99,54.93
  Bottom 0.152: v26.99,54.93 30.48,58.42 41.27,58.42 41.59,58.74 50.48,58.74 IC6.5
N$18
  Top 0.152: IC2.6 34.61,6.67 37.47,6.67 37.47,4.76 38.73,3.49 43.5,3.49 43.5,7.3 48.58,12.38 48.58,56.2 IC6.4
N$19  (via drill 0.33)
  Top 0.152: 68.9,89.22 68.9,78.42 IC9.19 68.9,76.52 68.9,65.72 IC10.19 | IC8.19 68.9,89.22 | IC7.19 69.22,102.23 69.22,96.52 68.9,96.2 68.9,89.22 | IC1.6 37.15,48.58 v37.15,61.59
  Bottom 0.152: v37.15,61.59 39.05,63.5 40.64,63.5 41.27,62.87 63.82,62.87 64.45,63.5 66.67,63.5 66.99,63.18 68.26,63.18 IC10.19
N$20  (via drill 0.33)
  Top 0.152: v66.99,53.34 67.31,53.66 IC10.1 68.26,58.1 68.26,68.9 IC9.1
  Bottom 0.152: IC1.11 28.26,49.21 38.42,49.21 42.55,53.34 v66.99,53.34
N$21  (via drill 0.33)
  Top 0.152: IC1.8 36.51,53.02 36.51,99.38 41.59,104.46 53.66,104.46 v53.66,96.52 | IC8.1 68.26,83.5 68.26,94.3 IC7.1
  Bottom 0.152: v53.66,96.52 53.98,96.84 63.5,96.84 65.09,95.25 IC7.1
N$22
  Top 0.152: IC11.11 27.62,39.05 27.62,91.12 41.27,104.78 54.61,104.78 IC3.11 55.88,101.6 55.88,91.44 IC4.11
N$58
  Top 0.152: IC15.4 IC16.13
N$59
  Top 0.152: IC15.5 IC16.12
N$60
  Top 0.152: IC14.4 IC15.13
N$61
  Top 0.152: IC14.5 IC15.12
N$62
  Top 0.152: IC13.4 IC14.13
N$63
  Top 0.152: IC13.5 IC14.12
N$64
  Top 0.152: IC15.11 53.66,24.45 53.66,13.65 IC16.11
  Bottom 0.152: IC12.3 27.3,14.61 52.7,14.61 IC16.11
N$65  (via drill 0.33)
  Top 0.152: v50.8,10.79 52.07,9.53 IC16.5
  Bottom 0.152: IC2.8 36.83,11.43 41.27,11.43 41.91,10.79 v50.8,10.79
N$66  (via drill 0.33)
  Top 0.152: v48.9,8.89 49.53,8.26 IC16.4
  Bottom 0.152: IC2.11 31.75,8.89 v48.9,8.89
N$83
  Top 0.152: 68.9,37.15 68.9,26.35 IC19.19 68.9,24.45 68.9,13.65 IC20.19 | IC18.19 68.9,37.15 | IC17.19 68.9,49.85 68.9,37.15
  Bottom 0.152: IC12.6 34.61,14.92 54.29,14.92 56.2,13.02 56.2,11.11 63.5,11.11 64.14,11.75 66.36,11.75 66.99,11.11 68.26,11.11 IC20.19
N$84  (via drill 0.33)
  Top 0.152: IC20.1 66.36,6.03 66.36,16.83 IC19.1 67.31,20.95 v66.67,21.59
  Bottom 0.152: IC12.11 30.48,21.59 v66.67,21.59
N$85  (via drill 0.33)
  Top 0.152: v66.99,27.62 67.31,27.94 IC18.1 68.26,31.43 68.26,42.23 IC17.1
  Bottom 0.152: IC12.8 36.51,27.62 v66.99,27.62
N$86
  Top 0.152: IC13.11 53.66,49.85 53.66,39.05 IC14.11
  Bottom 0.152: IC11.8 35.88,39.69 53.02,39.69 IC14.11
PC
  Top 0.152: IC2.12 25.4,16.51 IC12.4 24.13,20.32 IC12.12 IC11.3 IC11.4 | IC11.9 32.7,37.15 32.7,26.35 IC12.9
  Bottom 0.152: IC12.1 22.54,14.29 23.81,14.29 | IC2.12 23.81,14.29 | IC2.9 31.43,14.29 23.81,14.29 | IC11.4 27.94,29.21 | 27.94,29.21 IC12.9 | 27.94,29.21 IC11.5
R0D0  (via drill 0.33)
  Top 0.152: IC10.8 85.09,59.37 v83.82,60.64 v83.82,79.06
  Bottom 0.152: IC6.7 58.74,58.74 64.14,58.74 64.45,58.42 66.67,58.42 69.22,60.96 71.44,60.96 72.07,61.59 | 72.07,61.59 74.93,64.45 IC10.17 | v83.82,60.64 82.87,61.59 72.07,61.59 | JP1.5 90.81,78.74 90.49,79.06 v83.82,79.06
R0D1  (via drill 0.33)
  Top 0.152: IC6.6 55.24,56.52 v55.24,54.93 | IC10.6 IC10.15 80.01,66.67 v80.64,67.31
  Bottom 0.152: v55.24,54.93 55.56,55.24 73.34,55.24 73.66,55.56 78.42,55.56 IC10.6 | JP1.7 96.2,75.25 97.16,75.25 97.47,74.93 98.11,74.93 99.06,73.98 99.06,69.85 97.47,69.85 96.52,68.9 96.52,67.31 v80.64,67.31
R0D2  (via drill 0.33)
  Top 0.152: v86.04,72.71 86.04,65.72 IC10.13
  Bottom 0.152: IC6.2 46.04,55.56 68.26,55.56 | 68.26,55.56 73.03,55.56 74.61,57.15 IC10.4 | IC10.13 85.09,60.01 68.9,60.01 68.26,59.37 68.26,55.56 | JP1.9 94.3,72.71 v86.04,72.71
R0D3  (via drill 0.33)
  Top 0.152: IC6.3 47.94,56.2 v47.94,54.93 | v69.22,54.61 69.85,55.24 IC10.2 | v91.44,68.9 90.17,67.63 IC10.11
  Bottom 0.152: v47.94,54.93 48.58,54.29 68.9,54.29 v69.22,54.61 | IC10.11 90.17,59.69 69.22,59.69 68.58,59.05 68.58,57.15 IC10.2 | JP1.11 93.03,68.9 v91.44,68.9
R0D4  (via drill 0.33)
  Top 0.152: IC5.7 57.78,70.48 v57.78,74.3 | v75.88,71.44 75.25,72.07 75.25,77.15 IC9.17
  Bottom 0.152: JP1.13 94.93,68.26 86.68,68.26 IC9.8 83.5,71.44 v75.88,71.44 | v57.78,74.3 59.37,75.88 64.14,75.88 64.45,76.2 66.67,76.2 66.99,75.88 73.34,75.88 IC9.17
R0D5  (via drill 0.33)
  Top 0.152: IC5.6 55.56,68.9 v55.56,67.63 | IC9.6 IC9.15
  Bottom 0.152: v55.56,67.63 55.88,67.94 75.25,67.94 75.56,68.26 78.42,68.26 | IC9.6 78.42,68.26 | JP1.15 94.61,66.67 80.01,66.67 78.42,68.26
R0D6  (via drill 0.33)
  Top 0.152: v74.61,75.56 74.93,75.25 IC9.4 74.93,66.99 v75.56,66.36
  Bottom 0.152: IC5.2 46.04,68.26 73.34,68.26 IC9.4 | IC9.13 83.19,75.56 v74.61,75.56 | JP1.17 94.61,64.14 91.76,64.14 91.12,64.77 91.12,66.36 v75.56,66.36
R0D7  (via drill 0.33)
  Top 0.152: v93.98,75.56 v93.98,72.07 93.98,62.23 JP1.19 | IC5.3 48.9,67.94 v48.9,67.63 | v69.53,66.99 69.85,67.31 IC9.2 69.85,71.44 v70.48,72.07
  Bottom 0.152: IC9.11 92.08,75.56 v93.98,75.56 | v48.9,67.63 49.53,66.99 v69.53,66.99 | v70.48,72.07 v93.98,72.07
R0D8  (via drill 0.33)
  Top 0.152: v72.07,86.36 74.93,89.22 IC8.17 | IC8.8 82.23,85.41 v82.23,86.68 | JP1.21 93.34,60.33 v93.34,79.38
  Bottom 0.152: IC4.7 60.96,86.36 v72.07,86.36 81.92,86.36 v82.23,86.68 | v93.34,79.38 91.76,80.96 86.68,80.96 IC8.8
R0D9  (via drill 0.33)
  Top 0.152: IC8.15 IC8.6 78.74,81.28 v78.74,54.61
  Bottom 0.152: IC4.6 53.02,84.14 44.13,84.14 43.5,83.5 43.5,80.64 78.11,80.64 IC8.6 | JP1.23 93.98,54.61 v78.74,54.61
R0D10  (via drill 0.33)
  Top 0.152: v73.98,53.66 73.98,81.6 IC8.4
  Bottom 0.152: IC4.2 46.04,80.96 56.2,80.96 | 56.2,80.96 73.34,80.96 IC8.4 | IC8.13 86.68,91.76 87.95,91.76 88.58,91.12 88.58,88.27 65.72,88.27 65.09,88.9 61.91,88.9 57.15,84.14 56.83,84.14 56.2,83.5 56.2,80.96 | JP1.25 94.93,53.66 v73.98,53.66
R0D11  (via drill 0.33)
  Top 0.152: IC4.3 53.34,88.9 v53.34,90.81 | v91.44,52.7 91.44,67.94 92.08,68.58 92.08,88.27 IC8.11
  Bottom 0.152: v53.34,90.81 54.93,92.39 58.74,92.39 59.37,93.03 87.31,93.03 IC8.11 90.17,89.22 87,86.04 79.06,86.04 79.06,82.23 77.79,80.96 76.52,80.96 76.52,82.87 75.25,84.14 71.44,84.14 IC8.2 | JP1.27 94.61,51.44 92.71,51.44 v91.44,52.7
R0D12  (via drill 0.33)
  Top 0.152: IC3.7 58.74,96.84 58.74,103.82 60.01,105.09 86.04,105.09 86.04,100.01 | 86.04,96.2 86.04,100.01 | IC7.8 86.04,96.2 | IC7.17 76.52,104.46 83.82,104.46 83.82,102.23 86.04,100.01 | v86.04,49.21 86.36,49.53 86.36,72.07 86.68,72.39 86.68,77.79 86.04,78.42 86.04,96.2
  Bottom 0.152: JP1.29 94.3,49.21 v86.04,49.21
R0D13  (via drill 0.33)
  Top 0.152: IC3.6 55.24,94.61 v55.24,93.03 | IC7.15 IC7.6 81.28,93.98 81.28,64.14 80.33,63.18 80.33,61.91 80.96,61.28 80.96,46.35 v80.64,46.04
  Bottom 0.152: v55.24,93.03 55.56,93.34 78.11,93.34 IC7.6 | JP1.31 94.93,46.04 v80.64,46.04
R0D14  (via drill 0.33)
  Top 0.152: IC7.13 84.14,103.82 84.14,104.78 73.98,104.78 73.98,96.2 IC7.4 | JP1.33 96.52,44.45 96.52,58.74 97.47,59.69 99.06,59.69 v99.06,95.89
  Bottom 0.152: IC3.2 46.04,93.66 73.34,93.66 IC7.4 | v99.06,95.89 90.49,104.46 86.68,104.46 IC7.13
R0D15
  Top 0.152: JP1.35 93.98,41.91 93.98,51.44 94.3,51.75 94.3,52.7 92.71,54.29 92.71,90.81 89.22,94.3 89.22,101.92 IC7.11
  Bottom 0.152: IC3.3 48.9,97.16 63.82,97.16 64.45,96.52 66.67,96.52 66.99,96.84 67.31,96.84 | 67.31,96.84 67.94,96.84 69.53,95.25 IC7.2 | IC7.11 85.09,97.79 68.26,97.79 67.31,96.84
R1D0
  Top 0.152: IC16.7 58.74,3.49 73.98,3.49 | 73.98,3.49 85.09,3.49 IC20.8 | IC20.17 73.98,11.75 73.98,3.49
  Bottom 0.152: JP1.6 100.65,75.88 100.65,6.67 86.68,6.67 IC20.8
R1D1  (via drill 0.33)
  Top 0.152: IC16.6 56.52,3.17 86.04,3.17 | 86.04,3.17 86.04,6.67 83.82,8.89 | IC20.15 83.82,8.89 | 83.82,8.89 IC20.6 | v100.01,73.98 100.01,3.49 98.11,1.59 87.31,1.59 87.31,2.54 86.68,3.17 86.04,3.17
  Bottom 0.152: v100.01,73.98 JP1.8
R1D2  (via drill 0.33)
  Top 0.152: v76.83,7.94 74.93,6.03 IC20.4 | v53.02,73.66 50.48,71.12 50.48,11.43 44.45,5.4 IC16.2
  Bottom 0.152: IC16.2 46.04,3.49 73.34,3.49 IC20.4 | IC20.13 80.33,7.94 v76.83,7.94 | JP1.10 96.52,74.93 66.36,74.93 65.09,73.66 v53.02,73.66
R1D3  (via drill 0.33)
  Top 0.152: JP1.12 96.52,69.85 v96.52,59.69 | v90.81,55.24 90.81,52.07 91.12,51.75 91.12,13.65 IC20.11
  Bottom 0.152: IC16.3 50.8,8.89 66.04,8.89 67.63,7.3 | IC20.2 67.63,7.3 | IC20.11 84.77,7.3 67.63,7.3 | v96.52,59.69 96.52,57.15 92.71,57.15 v90.81,55.24
R1D4  (via drill 0.33)
  Top 0.152: IC15.7 55.88,19.05 v55.88,25.72 | IC19.8 83.82,19.05 v83.82,26.04 83.82,58.1 v84.45,58.74
  Bottom 0.152: v55.88,25.72 55.88,26.99 73.34,26.99 | IC19.17 73.34,26.99 | v83.82,26.04 82.87,26.99 73.34,26.99 | JP1.14 99.06,67.31 99.06,64.77 97.47,64.77 96.52,63.82 96.52,62.23 93.34,62.23 89.85,58.74 v84.45,58.74
R1D5  (via drill 0.33)
  Top 0.152: v56.83,15.56 IC15.6 | IC19.15 IC19.6 80.01,16.51 80.96,15.56 80.96,12.38 86.36,6.99 86.36,3.49 90.49,3.49 91.76,4.76 91.76,39.37 92.08,39.69 v92.08,64.77
  Bottom 0.152: v56.83,15.56 57.15,15.88 78.11,15.88 IC19.6 | JP1.16 96.52,64.77 v92.08,64.77
R1D6  (via drill 0.33)
  Top 0.152: v75.88,20 74.93,19.05 IC19.4
  Bottom 0.152: IC15.2 46.04,16.19 73.34,16.19 IC19.4 | 83.5,23.81 79.69,20 v75.88,20 | 83.5,23.81 IC19.13 | JP1.18 100.01,61.28 100.33,61.28 100.33,23.81 83.5,23.81
R1D7  (via drill 0.33)
  Top 0.152: IC19.2 70.8,18.73 70.8,27.3 v70.48,27.62
  Bottom 0.152: IC15.3 48.58,19.37 64.14,19.37 64.45,19.05 66.67,19.05 66.99,19.37 67.63,19.37 69.22,17.78 IC19.2 | 92.08,27.3 96.52,31.75 99.06,31.75 100.01,32.7 100.01,60.96 JP1.20 | 92.08,27.3 IC19.11 | v70.48,27.62 70.8,27.3 92.08,27.3
R1D8  (via drill 0.33)
  Top 0.152: v58.74,32.07 58.42,32.38 v58.42,40.64 | v74.3,40.96 74.93,40.32 IC18.17 74.93,33.34 v75.56,32.7 | JP1.22 99.06,57.15 v99.06,32.7
  Bottom 0.152: v58.74,32.07 IC14.7 | v58.42,40.64 58.74,40.96 v74.3,40.96 | 83.5,32.07 82.87,32.7 v75.56,32.7 | 83.5,32.07 IC18.8 | v99.06,32.7 98.42,32.07 83.5,32.07
R1D9  (via drill 0.33)
  Top 0.152: IC18.6 v80.01,33.97 IC18.15
  Bottom 0.152: IC14.6 53.02,32.07 44.13,32.07 43.5,31.43 43.5,28.57 75.25,28.57 75.56,28.89 78.42,28.89 IC18.6 | JP1.24 96.52,54.61 96.52,52.07 98.11,52.07 99.38,50.8 99.38,33.97 v80.01,33.97
R1D10  (via drill 0.33)
  Top 0.152: v85.09,33.34 IC18.13
  Bottom 0.152: IC14.2 46.04,28.89 73.34,28.89 IC18.4 74.93,33.02 75.25,33.34 v85.09,33.34 99.69,33.34 99.69,51.44 JP1.26
R1D11  (via drill 0.33)
  Top 0.152: IC14.3 47.94,31.43 v47.94,33.34 | v69.85,36.2 IC18.2 | v93.66,52.07 92.39,50.8 v92.39,39.05
  Bottom 0.152: v47.94,33.34 50.8,36.2 63.82,36.2 64.45,36.83 66.67,36.83 67.63,35.88 69.85,35.88 | 69.85,35.88 87.95,35.88 IC18.11 91.44,38.1 v92.39,39.05 | 69.85,35.88 v69.85,36.2 | JP1.28 96.84,51.75 95.89,51.75 95.57,52.07 v93.66,52.07
R1D12  (via drill 0.33)
  Top 0.152: v85.09,46.67 IC17.8 | v74.93,46.99 IC17.17
  Bottom 0.152: IC13.7 60.96,46.99 v74.93,46.99 85.09,46.99 | 85.09,46.99 96.52,46.99 JP1.30 | 85.09,46.99 v85.09,46.67
R1D13
  Top 0.152: IC17.15 IC17.6
  Bottom 0.152: IC13.6 54.61,49.21 54.93,49.21 56.2,50.48 56.2,52.39 63.82,52.39 66.99,49.21 78.42,49.21 IC17.15 | JP1.32 96.52,44.45 90.81,44.45 90.49,44.77 81.6,44.77 IC17.6
R1D14  (via drill 0.33)
  Top 0.152: v75.56,48.26 75.56,43.81 IC17.4
  Bottom 0.152: IC13.2 46.04,41.59 64.14,41.59 64.45,41.27 73.03,41.27 73.34,41.59 | IC17.4 73.34,41.59 | IC17.13 82.55,48.26 v75.56,48.26 | JP1.34 96.52,41.91 90.81,41.91 90.49,41.59 73.34,41.59
R1D15  (via drill 0.33)
  Top 0.152: IC13.3 47.94,42.23 v47.94,40.64 | v69.85,40.32 IC17.2
  Bottom 0.152: v47.94,40.64 48.58,40.01 69.85,40.01 | 69.85,40.01 92.08,40.01 92.71,40.64 93.66,40.64 94.93,39.37 96.52,39.37 JP1.36 99.06,40.64 99.06,48.58 98.11,49.53 91.44,49.53 IC17.11 | 69.85,40.01 v69.85,40.32
RESET  (via drill 0.33)
  Top 0.152: IC16.14 46.04,13.65 46.04,24.45 | IC15.14 46.04,24.45 | 46.04,37.15 IC14.14 | 46.04,24.45 46.04,37.15 | 46.04,49.85 IC13.14 | 46.04,37.15 v46.04,40.64 46.04,49.85 | 46.04,63.82 IC6.14 | 46.04,49.85 46.04,63.82 | 46.04,76.52 IC5.14 | 46.04,63.82 46.04,76.52 | 46.04,89.22 IC4.14 | 46.04,76.52 46.04,89.22 | IC3.14 46.04,101.92 46.04,89.22
  Bottom 0.152: X1.B11 8.89,41.91 17.46,41.91 18.73,40.64 v46.04,40.64
SP
  Top 0.152: IC11.12 23.18,39.05 23.18,49.85 IC1.12 | 30.8,31.43 IC11.6 | 30.8,31.43 30.8,49.85 IC1.9 | IC2.4 29.21,6.35 29.21,15.88 30.8,17.46 30.8,31.43
  Bottom 0.152: IC1.1 20.64,44.77 24.13,44.77 | 24.13,44.77 25.08,44.77 IC1.4 | 24.13,44.77 IC1.12 25.72,52.39 30.16,52.39 IC1.9 | IC2.1 21.91,6.67 26.35,6.67 IC2.4
SP/PC-ADDR-OUT  (via drill 0.33)
  Top 0.152: IC12.5 28.26,18.73 28.26,42.23 IC1.5 27.94,44.45 27.94,58.1 v28.26,58.42
  Bottom 0.152: X1.C18 12.7,58.42 v28.26,58.42
SP/PC-DATA-OUT-HI  (via drill 0.33)
  Top 0.152: IC12.10 30.16,26.35 30.16,49.85 IC1.10 29.21,56.83 v28.57,57.47
  Bottom 0.152: X1.C17 11.11,57.47 v28.57,57.47
SP/PC-DATA-OUT-LO
  Top 0.152: IC12.13 20.64,24.45 20.64,16.83 21.27,16.19 22.86,16.19 22.86,49.53 IC1.13
  Bottom 0.152: X1.C16 13.65,52.39 20,52.39 IC1.13
SP/PC-DN
  Top 0.152: X1.C21 11.75,66.99 11.75,10.16 18.73,3.17 30.48,3.17 IC2.5
  Bottom 0.152: IC2.5 IC2.13
SP/PC-LD-HI  (via drill 0.33)
  Top 0.152: v12.7,64.45 20.32,56.83 20.32,39.37 IC11.13
  Bottom 0.152: IC11.13 23.18,36.51 27.62,36.51 IC11.10 | X1.C20 11.75,64.45 v12.7,64.45
SP/PC-LD-LO  (via drill 0.33)
  Top 0.152: IC12.2 22.54,18.73 22.54,42.23 IC1.2 20.64,44.13 20.64,57.47 v15.24,62.87
  Bottom 0.152: X1.C19 10.79,62.87 v15.24,62.87
SP/PC-SEL  (via drill 0.33)
  Top 0.152: IC11.2 20,30.48 | 20,30.48 IC11.1 | v16.51,49.85 20,46.35 20,30.48
  Bottom 0.152: X1.C15 13.65,49.85 v16.51,49.85
SP/PC-UP
  Top 0.152: IC2.10 29.53,11.75 29.53,3.49 24.45,3.49 IC2.2 22.86,3.49 19.05,3.49 12.06,10.48 12.06,69.22 X1.C22
VCC
  Top 0.152: C1.1 63.5,8.89 63.5,19.05 | C11.1 63.5,19.05 | 63.5,19.05 63.5,23.18 64.45,24.13 64.45,32.7 C14.1 63.5,34.29 63.5,42.23 64.77,43.5 C15.1 63.5,46.99 63.5,48.58 64.77,49.85 C16.1 64.45,60.01 64.45,60.96 63.5,61.91 63.5,62.55 64.77,63.82 C17.1 63.5,73.66 63.5,86.36 | 63.5,86.36 C18.1 | 63.5,86.36 63.5,96.52 C19.1 63.5,99.06 63.5,100.65 64.45,101.6 66.36,101.6 | IC20.20 68.26,13.65 68.26,24.45 IC19.20 66.36,26.35 66.36,39.05 | 66.36,39.05 IC18.20 | 66.36,49.85 66.36,39.05 | IC17.20 66.36,49.85 | 66.36,63.82 IC10.20 | 66.36,49.85 66.36,63.82 | 66.36,76.52 IC9.20 | 66.36,63.82 66.36,76.52 | 66.36,89.22 IC8.20 | 66.36,76.52 66.36,89.22 | IC7.20 66.36,101.92 66.36,101.6 | 66.36,89.22 66.36,101.6 | X1.B2 X1.C2 | IC11.14 17.78,36.83 17.78,34.29 16.83,33.34 | C9.1 15.24,44.45 15.24,34.92 16.83,33.34 | 16.83,33.34 C13.1 16.51,27.94 IC12.14 19.05,22.86 C12.1 16.51,16.51 IC2.14 | C4.1 38.1,34.29 38.1,44.45 C5.1 | 40.32,14.29 39.37,15.24 C3.1 | 40.32,14.29 IC16.16 41.91,10.16 C2.1 | 42.86,24.45 IC15.16 | 42.86,24.45 42.86,16.83 40.32,14.29 | 42.86,37.15 IC14.16 | 42.86,24.45 42.86,37.15 | 42.86,37.15 42.86,49.85 IC13.16 42.86,51.75 42.86,65.72 | C6.1 38.1,60.96 38.1,69.22 39.37,70.48 C7.1 38.1,73.66 38.1,79.69 39.37,80.96 C8.1 | 42.86,65.72 IC6.16 | 42.86,76.52 42.86,65.72 | IC5.16 42.86,76.52 | 42.86,76.52 42.86,89.22 IC4.16 42.86,91.12 42.86,96.2 40.32,98.74 | X1.A31 X1.B31 X1.C31 | IC3.16 40.64,101.6 40.64,99.06 40.32,98.74 | C20.1 40.32,98.74
  Bottom 0.152: R1.2 97.47,19.37 68.26,19.37 67.31,20.32 C11.1 C3.1 24.13,20.32 IC12.14 | IC2.14 20.32,7.62 C10.1 | IC1.14 19.05,45.72 C9.1 | X1.B2 X1.A2 | C12.1 X1.C2 | IC13.16 41.91,45.72 C5.1 | IC4.16 41.91,85.09 C8.1 | X1.C31 13.97,97.79 C20.1

### Text on the board
tNames: YACC1 SP/PC BOARD V1.0 | onepagecomputer.com
tCream: 1